# EasyEDA Pro project PCB_EasyEDA-Legacy.epro

# Schematic promicro_e22P_Tomas
Board Name: promicro_e22P_Tomas; Create Date: 2026-05-04; Page Name: Sheet_1; Project Name: promicro_e22P_30_2026-04-24_20-44-31; Schematic Name: promicro_e22P_Tomas; Update Date: 2026-05-27; Add into BOM: yes; Company: CNCnet; Convert to PCB: yes; Date: 2026-04-01; Draw By: Radek Vicek; REV: 1.1; Sheet: 1/1; spicePre: .
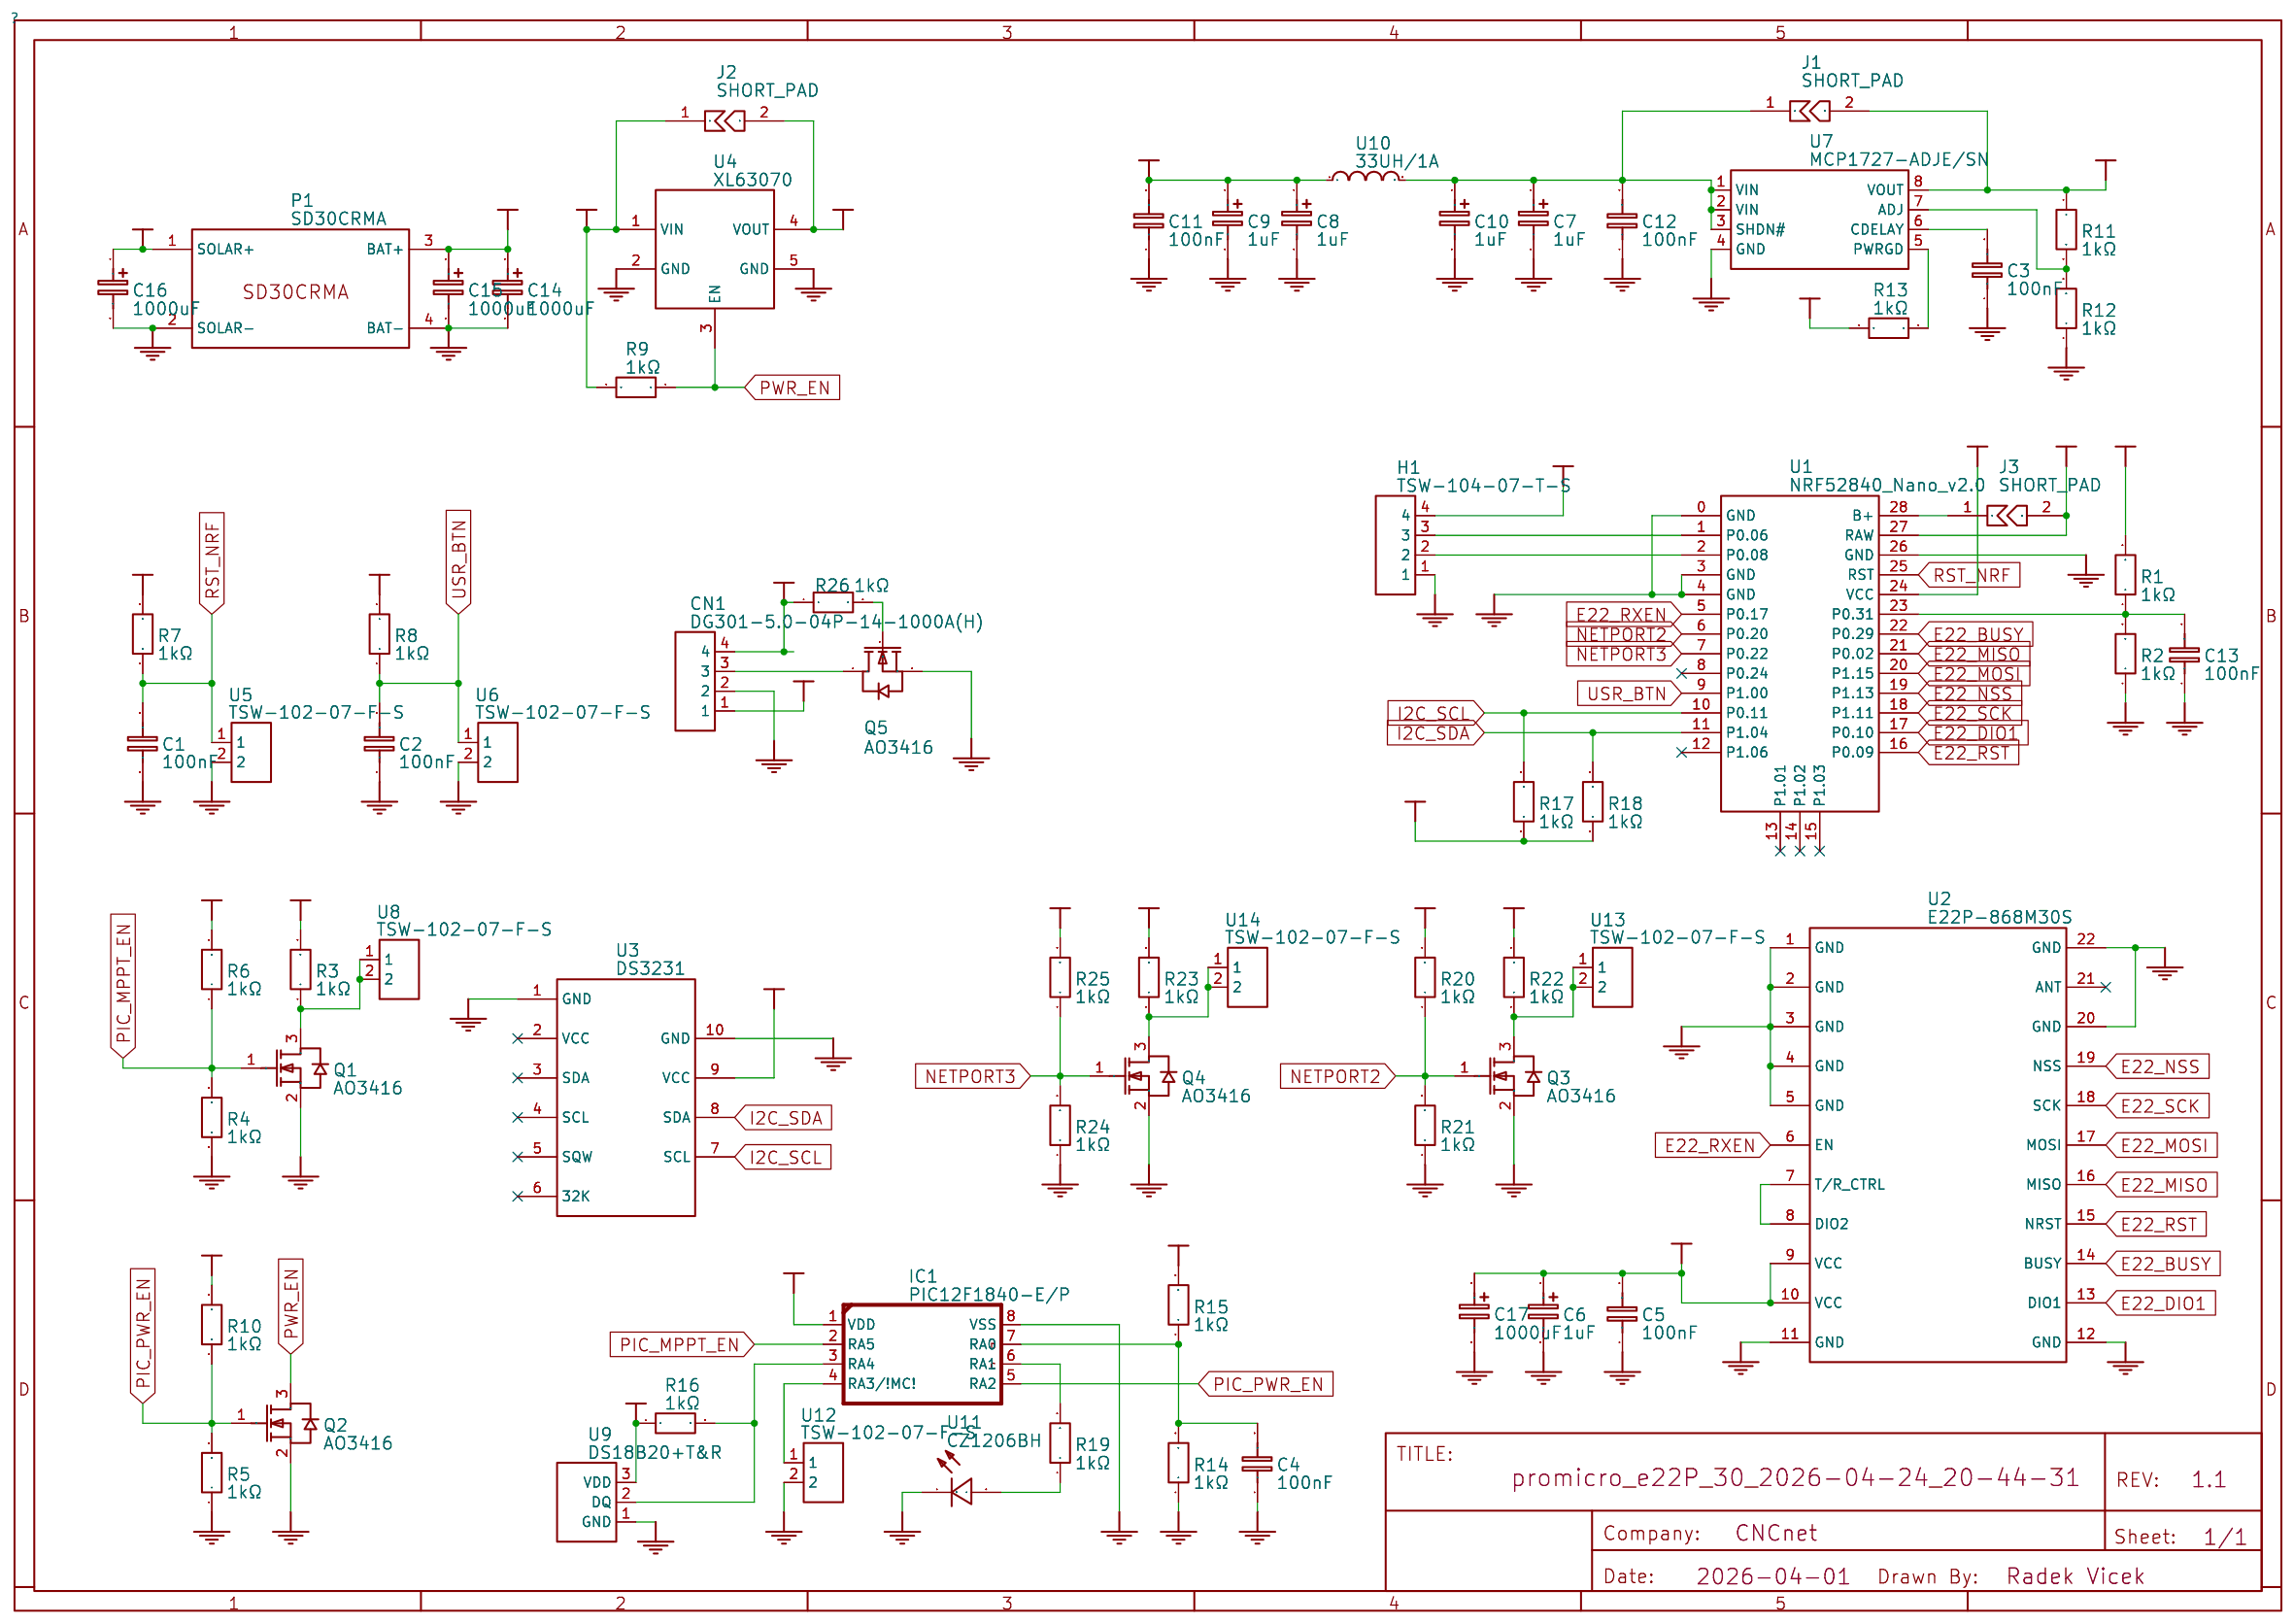
[diagram p0: schematic sheet]

## Parts
C1  100nF  [C1206]
C2  100nF  [C1206]
C3  100nF  [C1206]
C4  100nF  [C1206]
C5  100nF  [C1206]
C6  1uF  [CAP-SMD_L3.5-W2.8-R-RD]
C7  1uF  [CAP-SMD_L3.5-W2.8-R-RD]
C8  1uF  [CAP-SMD_L3.5-W2.8-R-RD]
C9  1uF  [CAP-SMD_L3.5-W2.8-R-RD]
C10  1uF  [CAP-SMD_L3.5-W2.8-R-RD]
C11  100nF  [C1206]
C12  100nF  [C1206]
C13  100nF  [C1206]
C14  1000uF  [CAP-D10.0×F5.0]
C15  1000uF  [CAP-D10.0×F5.0]
C16  1000uF  [CAP-D10.0×F5.0]
C17  1000uF  [CAP-D10.0×F5.0]
CN1  DG301-5.0-04P-14-1000A(H)  [CONN-TH_DEGSON_DG301-5.0-04P]
H1  TSW-104-07-T-S  [HDR-TH_4P-P2.54-V-M]
IC1  PIC12F1840-E/P  [DIL8-P]
J1  SHORT_PAD  [SHORT_PAD]
J2  SHORT_PAD  [SHORT_PAD]
J3  SHORT_PAD  [SHORT_PAD]
P1  SD30CRMA  [SD30CRMA]
Q1  AO3416  [SOT-23-3_L2.9-W1.3-P1.90-LS2.4-BR]
Q2  AO3416  [SOT-23-3_L2.9-W1.3-P1.90-LS2.4-BR]
Q3  AO3416  [SOT-23-3_L2.9-W1.3-P1.90-LS2.4-BR]
Q4  AO3416  [SOT-23-3_L2.9-W1.3-P1.90-LS2.4-BR]
Q5  AO3416  [SOT-23-3_L2.9-W1.3-P1.90-LS2.4-BR]
R1  1kΩ  [R1206]
R2  1kΩ  [R1206]
R3  1kΩ  [R1206]
R4  1kΩ  [R1206]
R5  1kΩ  [R1206]
R6  1kΩ  [R1206]
R7  1kΩ  [R1206]
R8  1kΩ  [R1206]
R9  1kΩ  [R1206]
R10  1kΩ  [R1206]
R11  1kΩ  [R1206]
R12  1kΩ  [R1206]
R13  1kΩ  [R1206]
R14  1kΩ  [R1206]
R15  1kΩ  [R1206]
R16  1kΩ  [R1206]
R17  1kΩ  [R1206]
R18  1kΩ  [R1206]
R19  1kΩ  [R1206]
R20  1kΩ  [R1206]
R21  1kΩ  [R1206]
R22  1kΩ  [R1206]
R23  1kΩ  [R1206]
R24  1kΩ  [R1206]
R25  1kΩ  [R1206]
R26  1kΩ  [R1206]
U1  NRF52840_Nano_v2.0  [NRF52840_NANO_V2,0]
U2  E22P-868M30S  [E22P-868M30S]
U3  DS3231  [DS3231]
U4  XL63070  [XL63070]
U5  TSW-102-07-F-S  [HDR-TH_2P-P2.54-V-M-3]
U6  TSW-102-07-F-S  [HDR-TH_2P-P2.54-V-M-3]
U7  MCP1727-ADJE/SN  [SOIC-8_L4.9-W3.9-P1.27-LS6.0-BL]
U8  TSW-102-07-F-S  [HDR-TH_2P-P2.54-V-M-3]
U9  DS18B20+T&R  [TO-92-3_L4.9-W3.7-P2.54-L]
U10  33UH/1A  [IND-TH_BD10.0-P5.00-D0.6]
U11  CZ1206BH  [LED-SMD_CZ1206BH]
U12  TSW-102-07-F-S  [HDR-TH_2P-P2.54-V-M-3]
U13  TSW-102-07-F-S  [HDR-TH_2P-P2.54-V-M-3]
U14  TSW-102-07-F-S  [HDR-TH_2P-P2.54-V-M-3]

## Library data of the parts
C1-C5 C11-C13 = CT41G-0805-2X1-50V-0.1uF-K(N): Capacitance:100nF Tolerance:±10% Tolerance:±10% Voltage Rating:50V Temperature Coefficient:-; LCSC Part Name: 100nF ±10% 50V; Supplier Part: C126469; Manufacturer: TORCH(火炬); Supplier Footprint: 0805; JLCPCB Part Class: Extended Part; Datasheet: https://item.szlcsc.com/datasheet/CT41G-0805-2X1-50V-0.1uF-K(N)/137749.html; Supplier: LCSC; Tolerance: ±10%; Voltage Rating: 50V
C6-C10 = TAJB105K035RNJ: Capacitance: Tolerance:±10% Tolerance:±10% Rated Voltage: Equivalent Series Resistance(ESR):6.5Ω@100kHz Operating Temperature:-55℃~+125℃ Operating Temperature:-55℃~+125℃; LCSC Part Name: 1uF ±10% 35V; Supplier Part: C7192; Manufacturer: Kyocera AVX; Supplier Footprint: CASE-B-3528-21(mm); JLCPCB Part Class: Extended Part; Datasheet: https://atta.szlcsc.com/upload/public/pdf/source/20160107/1457707750344.pdf; Supplier: LCSC; Tolerance: ±10%; Equivalent Series Resistance(ESR): 6.5Ω@100kHz; Operating Temperature: -55℃~+125℃
C14-C17 = PB25V1000M8X17: Capacitance:1000uF Tolerance:±20% Tolerance:±20% Voltage Rating:25V Ripple Current:4.5A@100kHz Equivalent Series Resistance(ESR):16mΩ@100kHz Type:Polymer Pin Spacing:3.5mm Diameter:8mm Height - Seated (Max):17mm Lifetime:5000hrs@105℃ Operating Temperature; LCSC Part Name: 1000uF ±20% 25V; Supplier Part: C51934175; Manufacturer: JIERR(捷而瑞); Supplier Footprint: 插件,D8xL17mm; JLCPCB Part Class: Extended Part; Datasheet: https://item.szlcsc.com/datasheet/PB25V1000M8X17/54649587.html; Supplier: LCSC; Tolerance: ±20%; Voltage Rating: 25V; Ripple Current: 4.5A@100kHz; Equivalent Series Resistance(ESR): 16mΩ@100kHz; Type: Polymer; Pin Spacing: 3.5mm; Diameter: 8mm; Height - Seated (Max): 17mm; Lifetime: 5000hrs@105℃; Operating Temperature: -55℃~+105℃
CN1 = DG301-5.0-04P-14-1000A(H): Supplier: LCSC; Supplier Part: C3037697; Manufacturer: DEGSON(高正/高松); JLCPCB Part Class: Extended Part; Contributor: lcsc; spicePre: C
H1 = TSW-104-07-T-S: Supplier: LCSC; Supplier Part: C7365925; Manufacturer: SAMTEC; JLCPCB Part Class: Extended Part; Contributor: lcsc; spicePre: H
IC1 = PIC12F1840-E/P: CPU Core:PIC CPU Maximum Speed:32MHz Core Size:8 Bit Program Storage Size:7KB Program Memory Type:FLASH RAM Size:256Byte EEPROM:256Byte Number of I/O:5 ADC (Bit):10bit DAC (Bit):5bit Oscillator Type:Built-in Voltage - Supply:2.3V~5.5V Voltage - Supply:2.3; LCSC Part Name: 采用XLP技术的8引脚闪存微控制器; Supplier Part: C640529; Manufacturer: MICROCHIP(美国微芯); Supplier Footprint: PDIP-8; JLCPCB Part Class: Extended Part; Datasheet: https://item.szlcsc.com/datasheet/PIC12F1840-E%252FP/670326.html; Supplier: LCSC; CPU Core: PIC; CPU Maximum Speed: 32MHz; Core Size: 8 Bit; Program Storage Size: 7KB; Program Memory Type: FLASH; RAM Size: 256Byte; EEPROM: 256Byte; Number of I/O: 5; ADC (Bit): 10bit; DAC (Bit): 5bit; Oscillator Type: Built-in; Voltage - Supply: 2.3V~5.5V; Operating Temperature: -40℃~+125℃
J1-J3 = SHORT_PAD: _: 3
P1 = SD30CRMA: Contributor: mrilic66; spicePre: P
Q1-Q5 = AO3416_C43307: Number:1 N-Channel Drain to Source Voltage:20V Current - Continuous Drain(Id):- RDS(on):22mΩ@4.5V,6.5A Pd - Power Dissipation:- Gate Threshold Voltage (Vgs(th)):1.1V Gate Charge(Qg):10nC@4.5V Input Capacitance(Ciss):1.65nF Reverse Transfer Capacitance (Cr; LCSC Part Name: 1个N沟道 耐压:20V 电流:6.5A; Supplier Part: C43307; Manufacturer: AOS; Supplier Footprint: SOT-23; JLCPCB Part Class: Extended Part; Datasheet: https://item.szlcsc.com/datasheet/AO3416/44298.html; Supplier: LCSC; Number: 1 N-Channel; Drain to Source Voltage: 20V; RDS(on): 22mΩ@4.5V,6.5A; Gate Threshold Voltage (Vgs(th)): 1.1V; Gate Charge(Qg): 10nC@4.5V; Input Capacitance(Ciss): 1.65nF; Reverse Transfer Capacitance (Crss@Vds): 87pF; Operating Temperature: -55℃~+150℃
R1-R26 = FRC0805J102 TS: Type:Thick Film Resistor Resistance:1kΩ Tolerance:±5% Tolerance:±5% Power(Watts):125mW Voltage-Supply(Max):150V Temperature Coefficient:±100ppm/℃ Temperature Coefficient:±100ppm/℃ Operating Temperature:-55℃~+155℃ Operating Temperature:-55℃~+155℃; LCSC Part Name: 1kΩ ±5% 125mW 厚膜电阻; Supplier Part: C2907295; Manufacturer: FOJAN(富捷); Supplier Footprint: 0805; JLCPCB Part Class: Extended Part; Supplier: LCSC; Type: Thick Film Resistor; Tolerance: ±5%; Power(Watts): 125mW; Voltage-Supply(Max): 150V; Temperature Coefficient: ±100ppm/℃; Operating Temperature: -55℃~+155℃
U1 = NRF52840_Nano_v2.0: Contributor: eugeniomercol; spicePre: U
U2 = E22P-868M30S: Supplier Part: C51912689; Manufacturer: EBYTE(亿佰特); Supplier Footprint: SMD,38.5x24mm; JLCPCB Part Class: Extended Part; Supplier: LCSC
U3 = DS3231: Manufacturer: IIOTSME; Supplier: IIOTSME; Contributor: mazran.iiotsme; spicePre: U
U4 = XL63070: Contributor: willyjestrabek; spicePre: U
U5 U6 U8 U12-U14 = TSW-102-07-F-S: Supplier: LCSC; Supplier Part: C3331037; Manufacturer: SAMTEC; JLCPCB Part Class: Extended Part; Contributor: lcsc; spicePre: U
U7 = MCP1727-ADJE/SN: Supplier: LCSC; Supplier Part: C635937; Manufacturer: MICROCHIP(美国微芯); JLCPCB Part Class: Extended Part; Contributor: LCSC; spicePre: U
U9 = DS18B20+T&R: Supplier: LCSC; Supplier Part: C880672; Manufacturer: ADI(亚德诺)/MAXIM(美信); JLCPCB Part Class: Extended Part; Contributor: LCSC; spicePre: U; spiceSymbolName: DS18B20+T&amp;R
U10 = 33UH/1A: Supplier: LCSC; Supplier Part: C9900019827; Manufacturer: null; Manufacturer Part: 33uH/1A; JLCPCB Part Class: Extended Part; Contributor: lcsc; spicePre: U
U11 = CZ1206BH: Supplier: LCSC; Supplier Part: C9900198175; Manufacturer: null; JLCPCB Part Class: Extended Part; Contributor: lcsc; spicePre: U

## Nets
+3V3: H1.4 R3.2 R6.2 R7.2 R8.2 R10.2 R17.1 R18.1 R20.2 R22.2 R23.2 R25.2 U1.24(VCC) U3.9(VCC)
+5V: C8.1 C9.1 C11.2 J2.2 U4.4(VOUT) U10.1
GND: C1.1 C2.1 C3.1 C4.1 C5.1 C6.2 C7.2 C8.2 C9.2 C10.2 C11.1 C12.1 C13.1 C14.2 C15.2 C16.2 C17.2 CN1.2 H1.1 IC1.8(VSS) P1.2(SOLAR-) P1.4(BAT-) Q1.2(S) Q2.2(S) Q3.2(S) Q4.2(S) Q5.2(S) R2.1 R4.1 R5.1 R12.1 R14.1 R21.1 R24.1 U1.0(GND) U1.3(GND) U1.4(GND) U1.26(GND) U2.1(GND) U2.2(GND) U2.3(GND) U2.4(GND) U2.5(GND) U2.11(GND) U2.12(GND) U2.20(GND) U2.22(GND) U3.1(GND) U3.10(GND) U4.2(GND) U4.5(GND) U5.2 U6.2 U7.4(GND) U9.1(GND) U11.1(C) U12.2
VBAT: C14.1 C15.1 CN1.4 IC1.1(VDD) J2.1 P1.3(BAT+) R1.2 R9.2 R15.2 R16.1 R26.1 U4.1(VIN) U9.3(VDD)
E22_BUSY: U1.22(P0.29) U2.14(BUSY)
E22_DIO1: U1.17(P0.10) U2.13(DIO1)
E22_MISO: U1.21(P0.02) U2.16(MISO)
E22_MOSI: U1.20(P1.15) U2.17(MOSI)
E22_NSS: U1.19(P1.13) U2.19(NSS)
E22_RST: U1.16(P0.09) U2.15(NRST)
E22_RXEN: U1.5(P0.17) U2.6(EN)
E22_SCK: U1.18(P1.11) U2.18(SCK)
I2C_SCL: R17.2 U1.10(P0.11) U3.7(SCL)
I2C_SDA: R18.2 U1.11(P1.04) U3.8(SDA)
NETPORT2: Q3.1(G) R20.1 R21.2 U1.6(P0.20)
NETPORT3: Q4.1(G) R24.2 R25.1 U1.7(P0.22)
PIC_MPPT_EN: IC1.2(RA5) Q1.1(G) R4.2 R6.1
PIC_PWR_EN: IC1.5(RA2) Q2.1(G) R5.2 R10.1
PWR_EN: Q2.3(D) R9.1 U4.3(EN)
RST_NRF: C1.2 R7.1 U1.25(RST) U5.1
USR_BTN: C2.2 R8.1 U1.9(P1.00) U6.1
VRAW: C5.2 C6.1 C17.1 J1.2 J3.2 R11.1 R13.2 U1.27(RAW) U2.9(VCC) U2.10(VCC) U7.8(VOUT)
VSOL: C16.1 CN1.1 P1.1(SOLAR+)
$1N10: U2.7(T/R CTRL) U2.8(DIO2)
$1N12: C13.2 R1.1 R2.2 U1.23(P0.31)
$1N32: Q1.3(D) R3.1 U8.1 U8.2
$1N33: R13.1 U7.5(PWRGD)
$1N35: C3.2 U7.6(CDELAY)
$1N37: R11.2 R12.2 U7.7(ADJ)
$1N43: IC1.3(RA4) R16.2 U9.2(DQ)
$1N45: C4.2 IC1.7(RA0) R14.2 R15.1
$1N53: C7.1 C10.1 C12.2 J1.1 U7.1(VIN) U7.2(VIN) U7.3(SHDN#) U10.2
$1N58: H1.3 U1.1(P0.06)
$1N62: H1.2 U1.2(P0.08)
$1N68: R19.1 U11.2(A)
$1N69: IC1.6(RA1) R19.2
$1N72: IC1.4(RA3/!MC!) U12.1
$1N75: Q3.3(D) R22.1 U13.1 U13.2
$1N84: Q4.3(D) R23.1 U14.1 U14.2
$1N86: J3.1 U1.28(B+)
$1N3345: CN1.3 Q5.3(D)
$1N3704: Q5.1(G) R26.2

Not connected (* = marked no-connect by the designer): U1 8(P0.24)* 12(P1.06)* 13(P1.01)* 14(P1.02)* 15(P1.03)*; U2 21(ANT)*; U3 2(VCC)* 3(SDA)* 4(SCL)* 5(SQW)* 6(32K)*

# Schematic promicro_e22P_30
Board Name: promicro_e22P_30; Create Date: 2026-04-24; Page Name: Sheet_1; Project Name: promicro_e22P_30_2026-04-24_20-44-31; Schematic Name: promicro_e22P_30; Update Date: 2026-04-24; Add into BOM: yes; Company: CNCnet; Convert to PCB: yes; Date: 2026-04-01; Draw By: Radek Vicek; REV: 1.0; Sheet: 1/1; spicePre: .
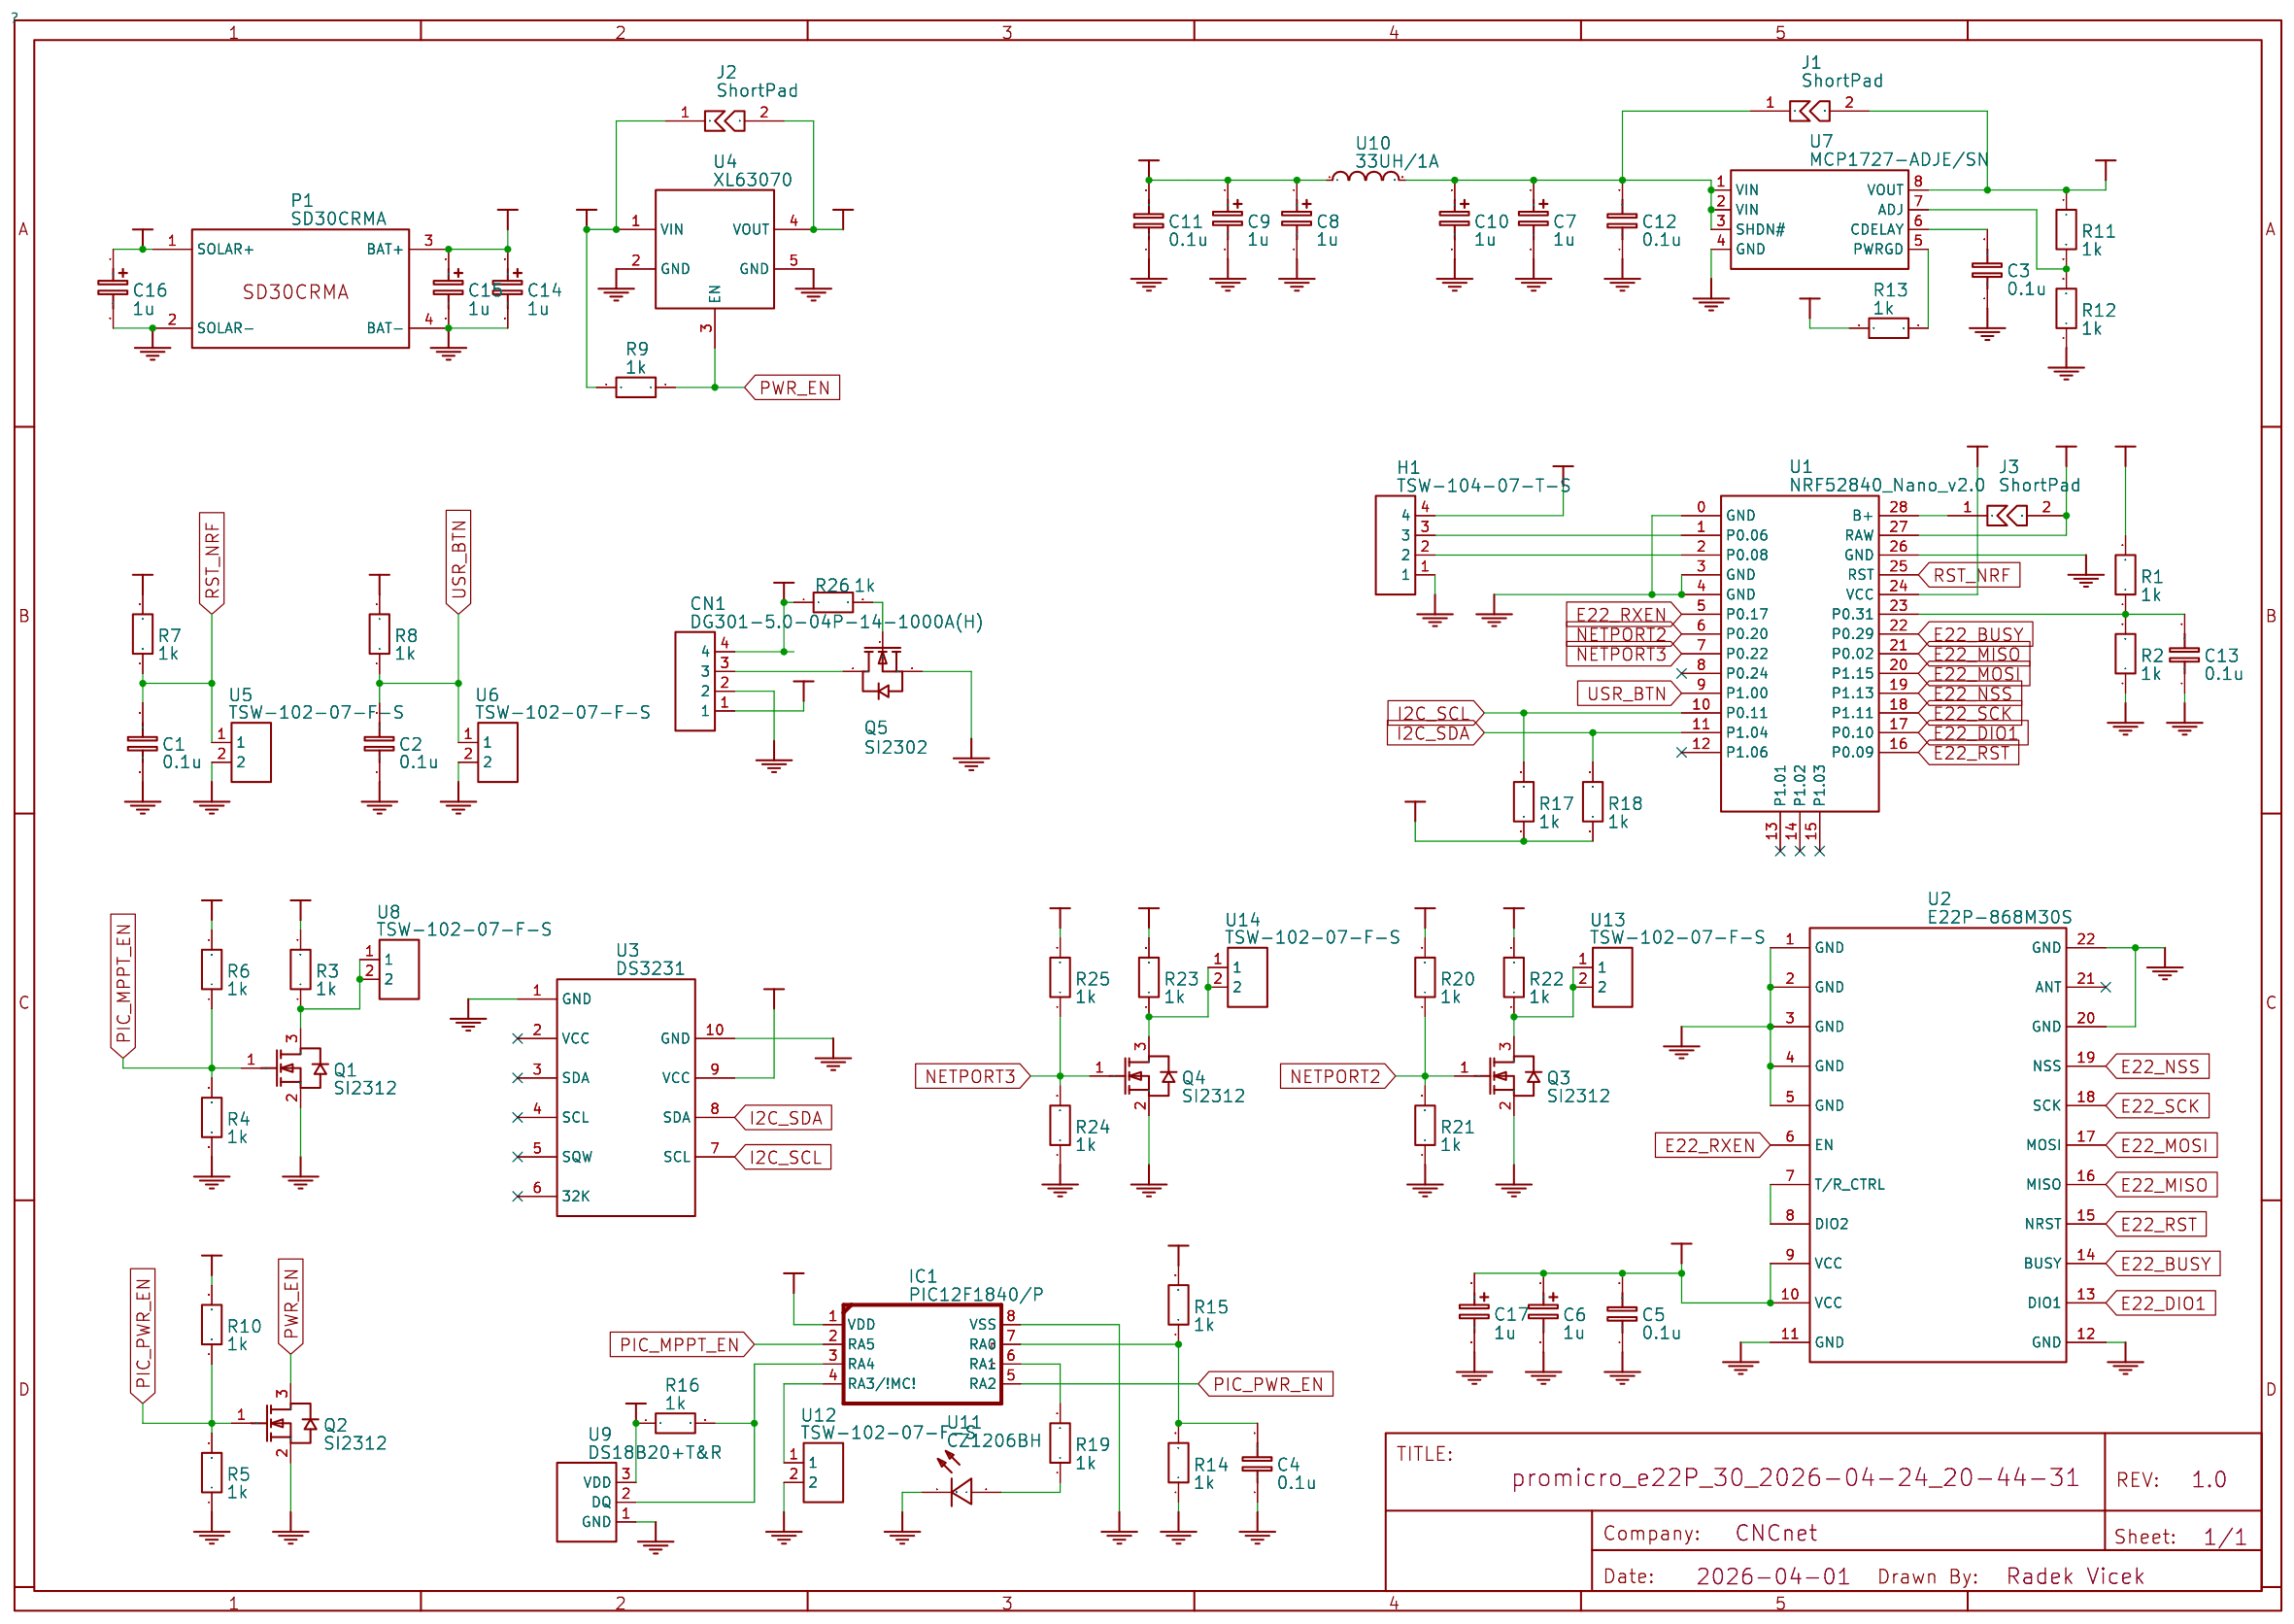
[diagram p1: schematic sheet]

## Parts
C1  0.1u  [C1206]
C2  0.1u  [C1206]
C3  0.1u  [C1206]
C4  0.1u  [C1206]
C5  0.1u  [C1206]
C6  1u  [CASE-B_3528]
C7  1u  [CASE-B_3528]
C8  1u  [CASE-B_3528]
C9  1u  [CASE-B_3528]
C10  1u  [CASE-B_3528]
C11  0.1u  [C1206]
C12  0.1u  [C1206]
C13  0.1u  [C1206]
C14  1u  [CAP-D10.0×F5.0]
C15  1u  [CAP-D10.0×F5.0]
C16  1u  [CAP-D10.0×F5.0]
C17  1u  [CAP-D10.0×F5.0]
CN1  DG301-5.0-04P-14-1000A(H)  [CONN-TH_DEGSON_DG301-5.0-04P]
H1  TSW-104-07-T-S  [HDR-TH_4P-P2.54-V-M]
IC1  PIC12F1840/P  [DIL8-P]
J1  ShortPad  [SHORTPAD]
J2  ShortPad  [SHORTPAD]
J3  ShortPad  [SHORTPAD]
P1  SD30CRMA  [SD30CRMA]
Q1  SI2312  [SOT-23-3_L2.9-W1.3-P1.90-LS2.4-BR]
Q2  SI2312  [SOT-23-3_L2.9-W1.3-P1.90-LS2.4-BR]
Q3  SI2312  [SOT-23-3_L2.9-W1.3-P1.90-LS2.4-BR]
Q4  SI2312  [SOT-23-3_L2.9-W1.3-P1.90-LS2.4-BR]
Q5  SI2302  [SOT-23-3_L2.9-W1.3-P1.90-LS2.4-BR]
R1  1k  [R1206]
R2  1k  [R1206]
R3  1k  [R1206]
R4  1k  [R1206]
R5  1k  [R1206]
R6  1k  [R1206]
R7  1k  [R1206]
R8  1k  [R1206]
R9  1k  [R1206]
R10  1k  [R1206]
R11  1k  [R1206]
R12  1k  [R1206]
R13  1k  [R1206]
R14  1k  [R1206]
R15  1k  [R1206]
R16  1k  [R1206]
R17  1k  [R1206]
R18  1k  [R1206]
R19  1k  [R1206]
R20  1k  [R1206]
R21  1k  [R1206]
R22  1k  [R1206]
R23  1k  [R1206]
R24  1k  [R1206]
R25  1k  [R1206]
R26  1k  [R1206]
U1  NRF52840_Nano_v2.0  [NRF52840_NANO_V2,0]
U2  E22P-868M30S  [E22P-868M30S]
U3  DS3231  [DS3231]
U4  XL63070  [XL63070]
U5  TSW-102-07-F-S  [HDR-TH_2P-P2.54-V-M-3]
U6  TSW-102-07-F-S  [HDR-TH_2P-P2.54-V-M-3]
U7  MCP1727-ADJE/SN  [SOIC-8_L4.9-W3.9-P1.27-LS6.0-BL]
U8  TSW-102-07-F-S  [HDR-TH_2P-P2.54-V-M-3]
U9  DS18B20+T&R  [TO-92-3_L4.9-W3.7-P2.54-L]
U10  33UH/1A  [IND-TH_BD10.0-P5.00-D0.6]
U11  CZ1206BH  [LED-SMD_CZ1206BH]
U12  TSW-102-07-F-S  [HDR-TH_2P-P2.54-V-M-3]
U13  TSW-102-07-F-S  [HDR-TH_2P-P2.54-V-M-3]
U14  TSW-102-07-F-S  [HDR-TH_2P-P2.54-V-M-3]

## Library data of the parts
C1-C5 C11-C13 = 0.1u: nameAlias: Value(F); Contributor: LCEDA_Lib; spicePre: C; spiceSymbolName: C_1206_EU
C6-C10 = 1u: nameAlias: Value(F); Contributor: LCEDA_Lib; spicePre: C; spiceSymbolName: C_Tan_SMD_B_EU
C14-C17 = 1u: nameAlias: Value(F); Contributor: LCEDA_Lib; spicePre: C; spiceSymbolName: CE_TH_D10.0×F5.0_EU
CN1 = DG301-5.0-04P-14-1000A(H): Supplier: LCSC; Supplier Part: C3037697; Manufacturer: DEGSON(高正/高松); JLCPCB Part Class: Extended Part; Contributor: lcsc; spicePre: C
H1 = TSW-104-07-T-S: Supplier: LCSC; Supplier Part: C7365925; Manufacturer: SAMTEC; JLCPCB Part Class: Extended Part; Contributor: lcsc; spicePre: H
IC1 = PIC12F1840/P: Contributor: kev.lum.10; spicePre: I
J1-J3 = ShortPad: Contributor: Prof.Es.Sional; spicePre: J
P1 = SD30CRMA: Contributor: mrilic66; spicePre: P
Q1-Q4 = SI2312: Supplier: LCSC; Supplier Part: C351405; Manufacturer: PUOLOP(迪浦); JLCPCB Part Class: Extended Part; Contributor: LCSC; spicePre: Q
Q5 = SI2302_C20628873: Number:1 N-Channel Drain to Source Voltage:20V Current - Continuous Drain(Id):3.3A RDS(on):75mΩ@2.5V Pd - Power Dissipation:1W Gate Threshold Voltage (Vgs(th)):1.5V@250uA Type:N-Channel; LCSC Part Name: 1个N沟道 耐压:20V 电流:3.3A; Supplier Part: C20628873; Manufacturer: FOSAN(富捷/富信); Supplier Footprint: SOT-23; JLCPCB Part Class: Extended Part; Datasheet: https://item.szlcsc.com/datasheet/SI2302/22043121.html; Supplier: LCSC; Number: 1 N-Channel; Drain to Source Voltage: 20V; Current - Continuous Drain(Id): 3.3A; RDS(on): 75mΩ@2.5V; Pd - Power Dissipation: 1W; Gate Threshold Voltage (Vgs(th)): 1.5V@250uA; Type: N-Channel
R1-R26 = 1k: nameAlias: Value(Ω); Contributor: LCEDA_Lib; spicePre: R; spiceSymbolName: R_1206_EU
U1 = NRF52840_Nano_v2.0: Contributor: eugeniomercol; spicePre: U
U2 = E22P-868M30S: Manufacturer: EBYTE; link: https://es.aliexpress.com/item/1005010297548005.html?aff_fcid=98de9c34a33349b49ae8ec5e9a0dc322-1773168861794-01273-_c3Rd26sf&aff_fsk=_c3Rd26sf&aff_platform=api-new-link-generate&sk=_c3Rd26sf&aff_trace_key=98de9c34a33349b49ae8ec5e9a0dc322-1773168861794-01273-_c3Rd26sf&terminal_id=b1642692874a40f0a20add40a61b4ff8&afSmartRedirect=y; Contributor: claudiu2001; spicePre: U
U3 = DS3231: Manufacturer: IIOTSME; Supplier: IIOTSME; Contributor: mazran.iiotsme; spicePre: U
U4 = XL63070: Contributor: willyjestrabek; spicePre: U
U5 U6 U8 U12-U14 = TSW-102-07-F-S: Supplier: LCSC; Supplier Part: C3331037; Manufacturer: SAMTEC; JLCPCB Part Class: Extended Part; Contributor: lcsc; spicePre: U
U7 = MCP1727-ADJE/SN: Supplier: LCSC; Supplier Part: C635937; Manufacturer: MICROCHIP(美国微芯); JLCPCB Part Class: Extended Part; Contributor: LCSC; spicePre: U
U9 = DS18B20+T&R: Supplier: LCSC; Supplier Part: C880672; Manufacturer: ADI(亚德诺)/MAXIM(美信); JLCPCB Part Class: Extended Part; Contributor: LCSC; spicePre: U; spiceSymbolName: DS18B20+T&amp;R
U10 = 33UH/1A: Supplier: LCSC; Supplier Part: C9900019827; Manufacturer: null; Manufacturer Part: 33uH/1A; JLCPCB Part Class: Extended Part; Contributor: lcsc; spicePre: U
U11 = CZ1206BH: Supplier: LCSC; Supplier Part: C9900198175; Manufacturer: null; JLCPCB Part Class: Extended Part; Contributor: lcsc; spicePre: U

## Nets
+3V3: H1.4 R3.2 R6.2 R7.2 R8.2 R10.2 R17.1 R18.1 R20.2 R22.2 R23.2 R25.2 U1.24(VCC) U3.9(VCC)
+5V: C8.1 C9.1 C11.2 J2.2 U4.4(VOUT) U10.1
GND: C1.1 C2.1 C3.1 C4.1 C5.1 C6.2 C7.2 C8.2 C9.2 C10.2 C11.1 C12.1 C13.1 C14.2 C15.2 C16.2 C17.2 CN1.2 H1.1 IC1.8(VSS) P1.2(SOLAR-) P1.4(BAT-) Q1.2(S) Q2.2(S) Q3.2(S) Q4.2(S) Q5.2(S) R2.1 R4.1 R5.1 R12.1 R14.1 R21.1 R24.1 U1.0(GND) U1.3(GND) U1.4(GND) U1.26(GND) U2.1(GND) U2.2(GND) U2.3(GND) U2.4(GND) U2.5(GND) U2.11(GND) U2.12(GND) U2.20(GND) U2.22(GND) U3.1(GND) U3.10(GND) U4.2(GND) U4.5(GND) U5.2 U6.2 U7.4(GND) U9.1(GND) U11.1(C) U12.2
VBAT: C14.1 C15.1 CN1.4 IC1.1(VDD) J2.1 P1.3(BAT+) R1.2 R9.2 R15.2 R16.1 R26.1 U4.1(VIN) U9.3(VDD)
E22_BUSY: U1.22(P0.29) U2.14(BUSY)
E22_DIO1: U1.17(P0.10) U2.13(DIO1)
E22_MISO: U1.21(P0.02) U2.16(MISO)
E22_MOSI: U1.20(P1.15) U2.17(MOSI)
E22_NSS: U1.19(P1.13) U2.19(NSS)
E22_RST: U1.16(P0.09) U2.15(NRST)
E22_RXEN: U1.5(P0.17) U2.6(EN)
E22_SCK: U1.18(P1.11) U2.18(SCK)
I2C_SCL: R17.2 U1.10(P0.11) U3.7(SCL)
I2C_SDA: R18.2 U1.11(P1.04) U3.8(SDA)
NETPORT2: Q3.1(G) R20.1 R21.2 U1.6(P0.20)
NETPORT3: Q4.1(G) R24.2 R25.1 U1.7(P0.22)
PIC_MPPT_EN: IC1.2(RA5) Q1.1(G) R4.2 R6.1
PIC_PWR_EN: IC1.5(RA2) Q2.1(G) R5.2 R10.1
PWR_EN: Q2.3(D) R9.1 U4.3(EN)
RST_NRF: C1.2 R7.1 U1.25(RST) U5.1
USR_BTN: C2.2 R8.1 U1.9(P1.00) U6.1
VRAW: C5.2 C6.1 C17.1 J1.2 J3.2 R11.1 R13.2 U1.27(RAW) U2.9(VCC) U2.10(VCC) U7.8(VOUT)
VSOL: C16.1 CN1.1 P1.1(SOLAR+)
$1N10: U2.7(T/R CTRL) U2.8(DIO2)
$1N12: C13.2 R1.1 R2.2 U1.23(P0.31)
$1N32: Q1.3(D) R3.1 U8.1 U8.2
$1N33: R13.1 U7.5(PWRGD)
$1N35: C3.2 U7.6(CDELAY)
$1N37: R11.2 R12.2 U7.7(ADJ)
$1N43: IC1.3(RA4) R16.2 U9.2(DQ)
$1N45: C4.2 IC1.7(RA0) R14.2 R15.1
$1N53: C7.1 C10.1 C12.2 J1.1 U7.1(VIN) U7.2(VIN) U7.3(SHDN#) U10.2
$1N58: H1.3 U1.1(P0.06)
$1N62: H1.2 U1.2(P0.08)
$1N68: R19.1 U11.2(A)
$1N69: IC1.6(RA1) R19.2
$1N72: IC1.4(RA3/!MC!) U12.1
$1N75: Q3.3(D) R22.1 U13.1 U13.2
$1N84: Q4.3(D) R23.1 U14.1 U14.2
$1N86: J3.1 U1.28(B+)
$1N3345: CN1.3 Q5.3(D)
$1N3704: Q5.1(G) R26.2

Not connected (* = marked no-connect by the designer): U1 8(P0.24)* 12(P1.06)* 13(P1.01)* 14(P1.02)* 15(P1.03)*; U2 21(ANT)*; U3 2(VCC)* 3(SDA)* 4(SCL)* 5(SQW)* 6(32K)*

# Board PCB_promicro_e22P_30_Tomas
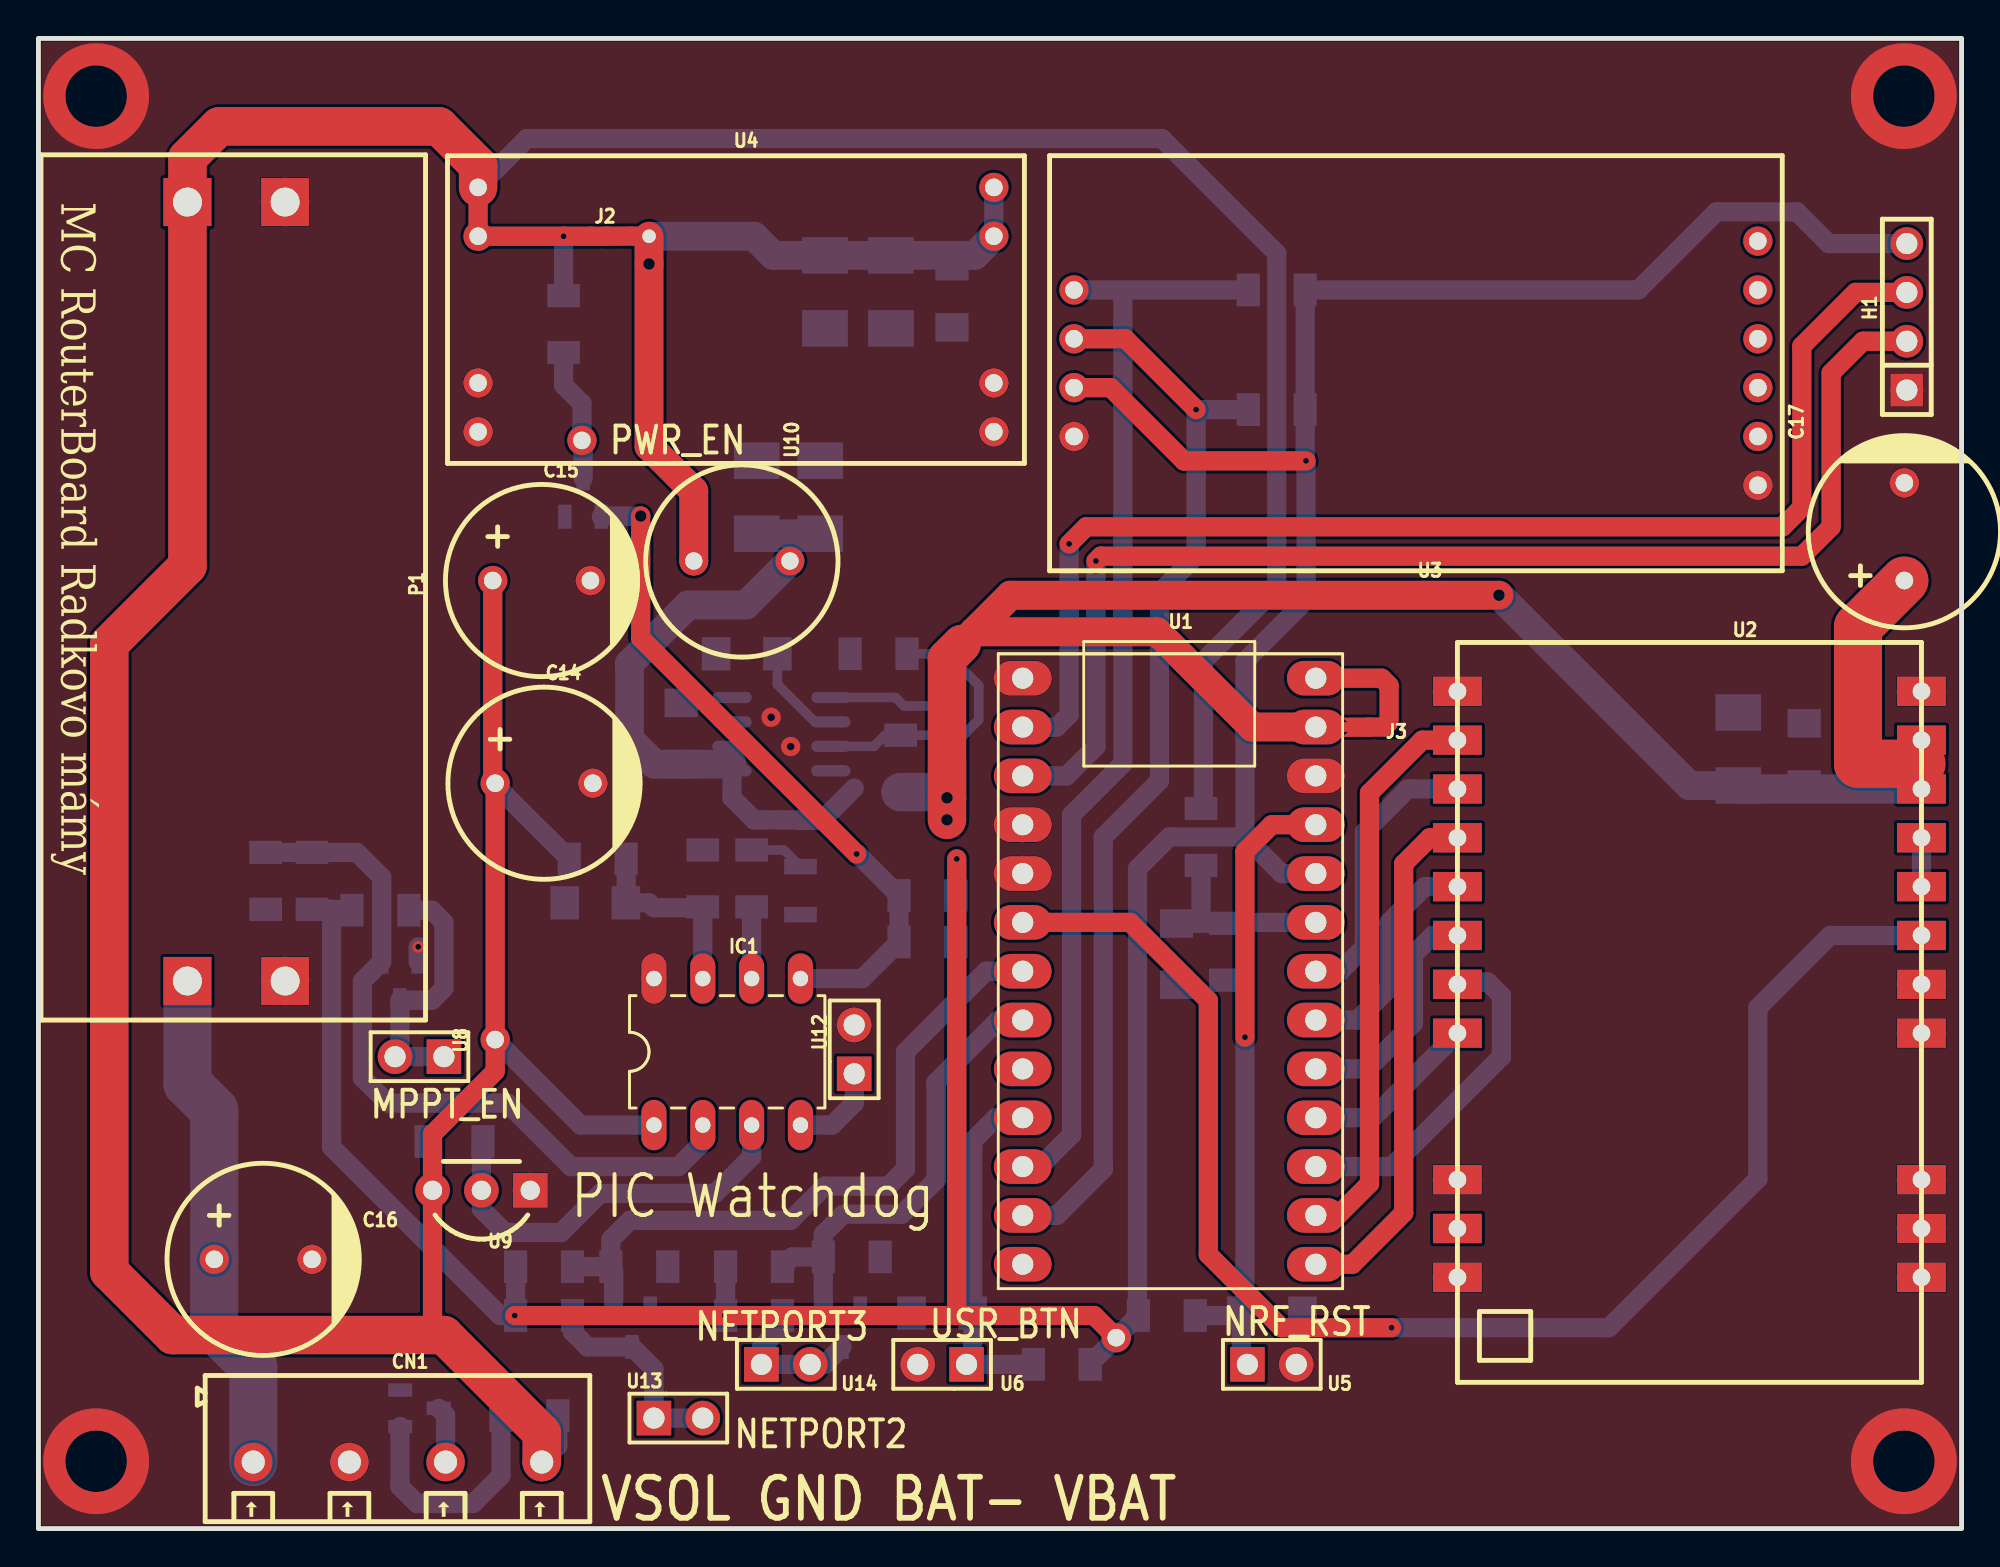
[diagram p2: board, top side]
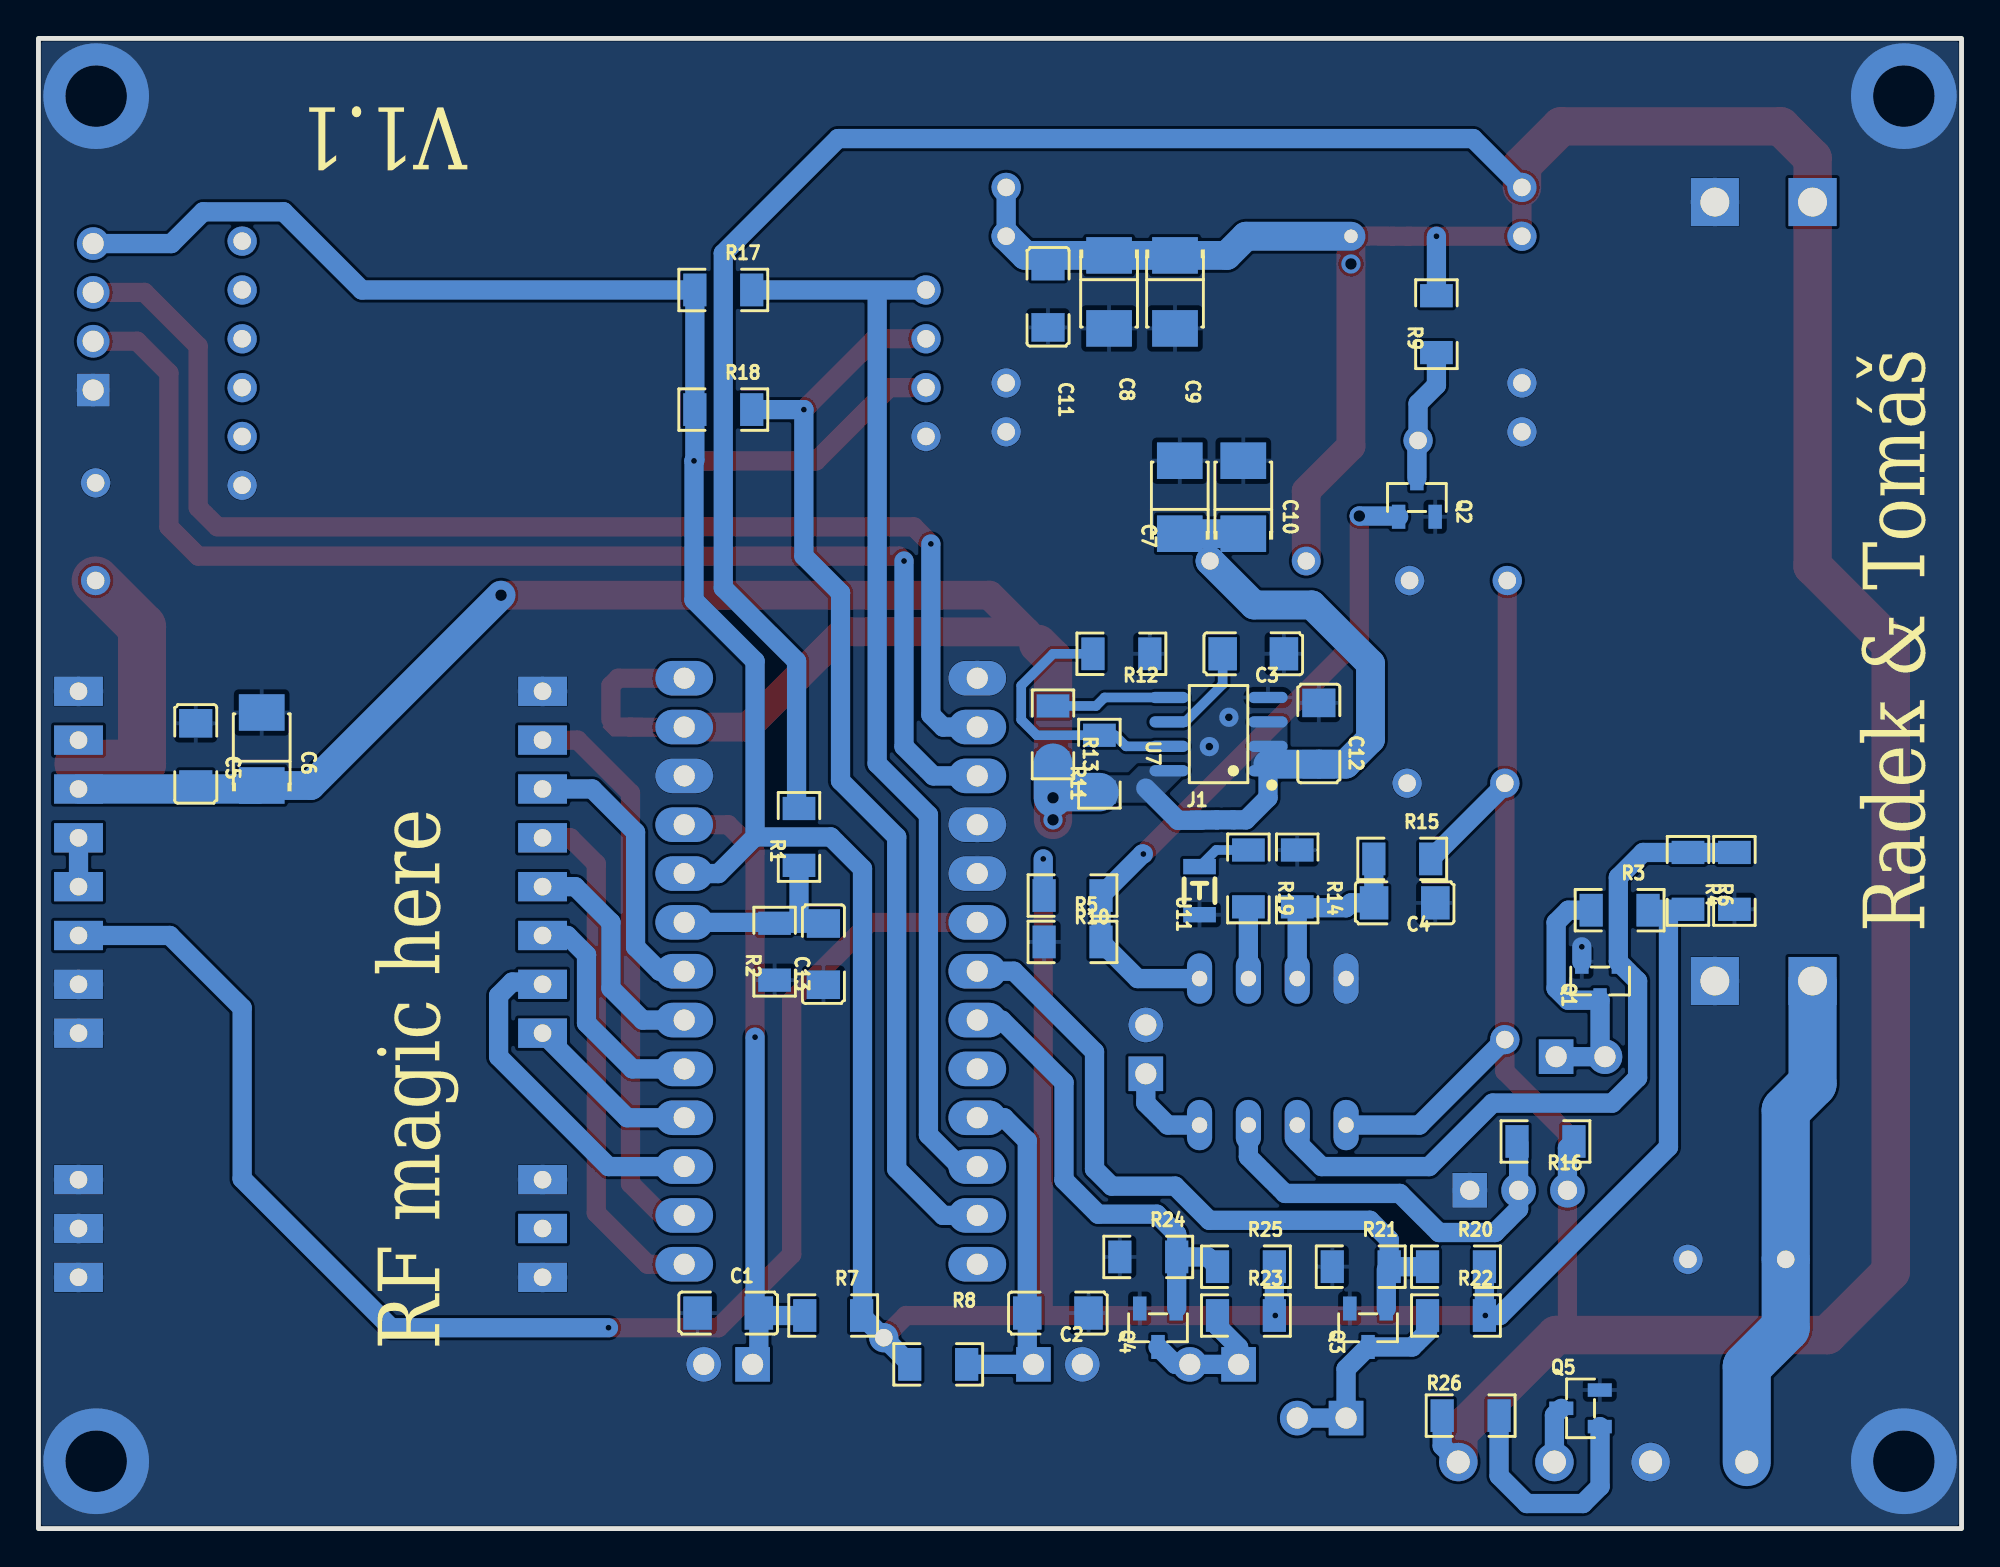
[diagram p3: board, bottom side, seen from below]

Outline 100 x 77.5 mm; copper layers: Top Layer, Bottom Layer. Coordinates in mm from the lower left corner of the outline.
Outline path: rectangle 0,77.5 100,0
Stack: Top Layer 0.035mm / Dielectric1 1.51mm FR4 er 4.5 / Bottom Layer 0.035mm

## Design rules (mm)
spacing Default (default): track to track 0.152, other pairs 0 to 0.152
spacing Plane_Default: track to track 0.152, other pairs 0 to 0.152
spacing Copper_Default: track to track 0.152, other pairs 0 to 0.152
track width Default (default): min 0.254, default 0.254, max 25.4
differential pair differentialPair (default): width min 0.127, default 0.254, max 2.54; gap min 0.152, default 0.152
pour e303 uses Copper_Default
pour e426 uses Copper_Default

## Placement (name value [footprint] x y rotation side)
C1  100nF  [C1206]  64.13 11.21 180 bottom
C2  100nF  [C1206]  46.99 11.21 0 bottom
C3  100nF  [C1206]  36.83 45.5 0 bottom
C4  100nF  [C1206]  28.96 32.54 0 bottom
C5  100nF  [C1206]  91.82 40.29 270 bottom
C6  1uF  [CAP-SMD_L3.5-W2.8-R-RD]  88.39 40.54 270 bottom
C7  1uF  [CAP-SMD_L3.5-W2.8-R-RD]  40.65 53.64 270 bottom
C8  1uF  [CAP-SMD_L3.5-W2.8-R-RD]  44.33 64.32 90 bottom
C9  1uF  [CAP-SMD_L3.5-W2.8-R-RD]  40.9 64.32 90 bottom
C10  1uF  [CAP-SMD_L3.5-W2.8-R-RD]  37.35 53.64 270 bottom
C11  100nF  [C1206]  47.5 64.06 90 bottom
C12  100nF  [C1206]  33.42 41.35 270 bottom
C13  100nF  [C1206]  59.18 29.88 90 bottom
C14  1000uF  [CAP-D10.0×F5.0]  26.29 38.77 0 top
C15  1000uF  [CAP-D10.0×F5.0]  26.16 49.31 0 top
C16  1000uF  [CAP-D10.0×F5.0]  11.68 14 0 top
C17  1000uF  [CAP-D10.0×F5.0]  97.03 51.85 90 top
CN1  DG301-5.0-04P-14-1000A(H)  [CONN-TH_DEGSON_DG301-5.0-04P]  18.67 3.46 0 top
H1  TSW-104-07-T-S  [HDR-TH_4P-P2.54-V-M]  97.16 63.02 90 top
IC1  PIC12F1840-E/P  [DIL8-P]  35.81 24.8 0 top
J1  -  [SHORT_PAD]  38.35 36.86 0 bottom
J2  -  [SHORT_PAD]  29.21 67.21 0 top
J3  -  [SHORT_PAD]  69.6 41.69 180 top
NOREF  -  [Pad_e19]  23.75 25.43 0 top
NOREF#2  -  [Pad_e20]  56.04 9.93 0 top
NOREF#3  -  [Pad_e21]  31.75 67.21 0 top
P1  -  [SD30CRMA]  0.13 26.45 90 top
Q1  AO3416  [SOT-23-3_L2.9-W1.3-P1.90-LS2.4-BR]  18.8 28.48 90 bottom
Q2  AO3416  [SOT-23-3_L2.9-W1.3-P1.90-LS2.4-BR]  28.32 53.62 270 bottom
Q3  AO3416  [SOT-23-3_L2.9-W1.3-P1.90-LS2.4-BR]  30.86 10.44 90 bottom
Q4  AO3416  [SOT-23-3_L2.9-W1.3-P1.90-LS2.4-BR]  41.78 10.44 90 bottom
Q5  AO3416  [SOT-23-3_L2.9-W1.3-P1.90-LS2.4-BR]  19.81 6.25 180 bottom
R1  1kΩ  [R1206]  60.45 35.97 90 bottom
R2  1kΩ  [R1206]  61.72 30 90 bottom
R3  1kΩ  [R1206]  17.78 32.16 180 bottom
R4  1kΩ  [R1206]  11.81 33.69 90 bottom
R5  1kΩ  [R1206]  46.23 30.51 180 bottom
R6  1kΩ  [R1206]  14.22 33.69 270 bottom
R7  1kΩ  [R1206]  58.67 11.08 180 bottom
R8  1kΩ  [R1206]  53.21 8.54 0 bottom
R9  1kΩ  [R1206]  27.31 62.64 90 bottom
R10  1kΩ  [R1206]  46.23 32.92 0 bottom
R11  1kΩ  [R1206]  44.83 39.78 90 bottom
R12  1kΩ  [R1206]  43.69 45.5 0 bottom
R13  1kΩ  [R1206]  47.24 41.31 270 bottom
R14  1kΩ  [R1206]  34.54 33.81 270 bottom
R15  1kΩ  [R1206]  29.08 34.83 180 bottom
R16  1kΩ  [R1206]  21.64 20.13 0 bottom
R17  1kΩ  [R1206]  64.39 64.42 180 bottom
R18  1kΩ  [R1206]  64.39 58.2 180 bottom
R19  1kΩ  [R1206]  37.08 33.81 270 bottom
R20  1kΩ  [R1206]  26.29 13.62 180 bottom
R21  1kΩ  [R1206]  31.24 13.62 180 bottom
R22  1kΩ  [R1206]  26.29 11.08 180 bottom
R23  1kΩ  [R1206]  37.21 11.08 180 bottom
R24  1kΩ  [R1206]  42.29 14.13 180 bottom
R25  1kΩ  [R1206]  37.21 13.62 180 bottom
R26  1kΩ  [R1206]  25.53 5.87 180 bottom
U1  NRF52840_Nano_v2.0  [NRF52840_NANO_V2,0]  50.04 12.48 0 top
U2  -  [E22P-868M30S]  85.85 28.31 0 top
U3  -  [DS3231]  88.14 55.53 180 top
U4  -  [XL63070]  22.86 69.75 0 top
U5  TSW-102-07-F-S  [HDR-TH_2P-P2.54-V-M-3]  64.13 8.54 0 top
U6  TSW-102-07-F-S  [HDR-TH_2P-P2.54-V-M-3]  46.99 8.54 180 top
U7  MCP1727-ADJE/SN  [SOIC-8_L4.9-W3.9-P1.27-LS6.0-BL]  38.63 41.32 90 bottom
U8  TSW-102-07-F-S  [HDR-TH_2P-P2.54-V-M-3]  19.81 24.54 180 top
U9  DS18B20+T&R  [TO-92-3_L4.9-W3.7-P2.54-L]  23.03 17.59 180 top
U10  33UH/1A  [IND-TH_BD10.0-P5.00-D0.6]  36.58 50.32 0 top
U11  CZ1206BH  [LED-SMD_CZ1206BH]  39.62 33.18 90 bottom
U12  TSW-102-07-F-S  [HDR-TH_2P-P2.54-V-M-3]  42.42 24.92 90 top
U13  TSW-102-07-F-S  [HDR-TH_2P-P2.54-V-M-3]  33.27 5.75 0 top
U14  TSW-102-07-F-S  [HDR-TH_2P-P2.54-V-M-3]  38.86 8.54 0 top

## Footprints (pads in the part's own frame, mm; a bottom-side part is the same pattern mirrored in y, then rotated)
C1206
  rect 1.485x1.728 smd: 1(-1.593,0) 2(1.593,0)
CAP-D10.0×F5.0
  round 1.524 hole 0.914: 1(-2.54,0) 2(2.54,0)
CAP-SMD_L3.5-W2.8-R-RD
  rect 1.9x2.376 smd: 1(1.899,0) 2(-1.899,0)
CONN-TH_DEGSON_DG301-5.0-04P
  round 2 hole 1.2: 1(-7.5,0) 2(-2.5,0) 3(2.5,0) 4(7.5,0)
DIL8-P
  oval 1.308x2.616 hole 0.8x0.805: 1(-3.81,-3.81) 2(-1.27,-3.81) 3(1.27,-3.81) 4(3.81,-3.81) 5(3.81,3.81) 6(1.27,3.81) 7(-1.27,3.81) 8(-3.81,3.81)
DS3231
  round 1.524 hole 0.914: 1(-1.27,1.27) 2(-1.27,-1.27) 3(-1.27,-3.81) 4(-1.27,-6.35) 5(-1.27,-8.89) 6(-1.27,-11.43) 7(34.29,-8.89) 8(34.29,-6.35) 9(34.29,-3.81) 10(34.29,-1.27)
E22P-868M30S
  rect 2.54x1.524 hole 0.914: 1(12.065,-15.24) 2(12.065,-12.7) 3(12.065,-10.16) 4(12.065,-2.54) 5(12.065,0) 6(12.065,2.54) 7(12.065,5.08) 8(12.065,7.62) 9(12.065,10.16) 10(12.065,12.7) 11(12.065,15.24) 12(-12.065,15.24) 13(-12.065,12.7) 14(-12.065,10.16) 15(-12.065,7.62) 16(-12.065,5.08) 17(-12.065,2.54) 18(-12.065,0) 19(-12.065,-2.54) 20(-12.065,-10.16) 21(-12.065,-12.7) 22(-12.065,-15.24)
HDR-TH_2P-P2.54-V-M-3
  rect 1.8x1.8 hole 1.1: 1(-1.27,0)
  round 1.8 hole 1.1: 2(1.27,0)
HDR-TH_4P-P2.54-V-M
  rect 1.7x1.7 hole 1.1: 1(-3.81,0)
  round 1.7 hole 1.1: 2(-1.27,0) 3(1.27,0) 4(3.81,0)
IND-TH_BD10.0-P5.00-D0.6
  round 1.5 hole 0.9: 1(-2.5,0) 2(2.5,0)
LED-SMD_CZ1206BH
  rect 0.8x1.7 smd: 1(-1.25,0) 2(1.25,0)
NRF52840_NANO_V2,0
  oval 3x1.8 hole 1.1: 0(1.143,31.75) 1(1.143,29.21) 2(1.143,26.67) 3(1.143,24.13) 4(1.143,21.59) 5(1.143,19.05) 6(1.143,16.51) 7(1.143,13.97) 8(1.143,11.43) 9(1.143,8.89) 10(1.143,6.35) 11(1.143,3.81) 12(1.143,1.27) 16(16.383,1.27) 17(16.383,3.81) 18(16.383,6.35) 19(16.383,8.89) 20(16.383,11.43) 21(16.383,13.97) 22(16.383,16.51) 23(16.383,19.05) 24(16.383,21.59) 25(16.383,24.13) 26(16.383,26.67) 27(16.383,29.21) 28(16.383,31.75)
Pad_e19
  round 1.524 hole 0.914: 1(0,0)
Pad_e20
  round 1.524 hole 0.914: 1(0,0)
Pad_e21
  round 1 hole 0.7: 1(0,0)
R1206
  rect 1.208x1.701 smd: 1(-1.479,0) 2(1.479,0)
SD30CRMA
  rect 2.5x2.5 hole 1.5x1.5: 1(2.032,-7.62) 2(2.032,-12.7) 3(42.545,-7.62) 4(42.544,-12.7)
SHORT_PAD
  custom 1.579x1.003 smd: 1(-0.29,-0.001)
  custom 1.528x1.012 smd: 2(1.014,0.006)
SOIC-8_L4.9-W3.9-P1.27-LS6.0-BL
  oval 0.588x2.045 smd: 1(-1.905,-2.57) 2(-0.635,-2.57) 3(0.635,-2.57) 4(1.905,-2.57) 5(1.905,2.57) 6(0.635,2.57) 7(-0.635,2.57) 8(-1.905,2.57)
SOT-23-3_L2.9-W1.3-P1.90-LS2.4-BR
  rect 1.25x0.7 smd: 1(1,-0.95) 2(1,0.95) 3(-1,0)
TO-92-3_L4.9-W3.7-P2.54-L
  rect 1.8x1.8 hole 1: 1(-2.54,0)
  round 1.8 hole 1: 2(0,0) 3(2.54,0)
XL63070
  round 1.524 hole 0.914: 1(0,0) 1(0,-2.54) 2(0,-10.17) 2(0,-12.71) 3(5.4,-13.16) 4(26.82,0) 4(26.82,-2.54) 5(26.82,-10.17) 5(26.82,-12.71)

## Nets
As in the schematic, except:
+3V3: H1.4 NOREF#2.1 R3.2 R6.2 R7.2 R8.2 R10.2 R17.1 R18.1 R20.2 R22.2 R23.2 R25.2 U1.24 U3.9
+5V: C8.1 C9.1 C11.2 J2.2 NOREF#3.1 U4.4 U10.1
VBAT: C14.1 C15.1 CN1.4 IC1.1 J2.1 NOREF.1 P1.3 R1.2 R9.2 R15.2 R16.1 R26.1 U4.1 U9.3

Pads without a net: U1 8 12; U2 21; U3 2 3 4 5 6

## Via types
v1: diameter 0.61, hole 0.305, Top Layer to Bottom Layer, 12 vias
v2: diameter 1, hole 0.4, Top Layer to Bottom Layer, 2 vias
v3: diameter 5.5, hole 3.2, Top Layer to Bottom Layer, 4 vias
v4: diameter 1, hole 0.6, Top Layer to Bottom Layer, 5 vias

## Routing (per net, layer and track width the routed paths; a pad name or vN(x,y) marks a point on that pad's centre or on a via; arc(x,y) is an arc through that point)
+3V3: length 204.8
  Top Layer w1: v1(24.77,11.08) v1(35.69,11.08) 54.89,11.08 NOREF#2.1 ; v1(65.91,55.53) 59.56,55.53 55.75,59.34 U3.9 ; v1(47.75,34.83) 47.75,11.09
  Bottom Layer w1: R8.2 54.69,8.58 NOREF#2.1 R7.2 57.15,11.12 57.15,34.32 58.8,35.97 62.74,35.97 ; R20.2 R22.2 24,11.08 15.24,19.84 15.24,32.21 ; R25.2 R23.2 ; R3.2 16.26,32.21 15.24,32.21 ; 15.24,32.21 R6.2 ; 62.74,35.97 62.74,45.11 65.91,48.29 v1(65.91,55.53) 65.87,55.57 R18.1 R17.1 83.19,64.42 87.25,68.48 91.44,68.48 93.09,66.83 H1.4 ; 62.74,35.97 64.64,34.07 66.42,34.07 ; R10.2 47.75,32.97 v1(47.75,34.83)
+5V: length 39.9
  Top Layer w1: NOREF#3.1 30.99,67.21
  Top Layer w1.5: U10.1 34.08,53.97 31.75,56.29 v4(31.75,65.77) NOREF#3.1
  Bottom Layer w1: U4.4 U4.4
  Bottom Layer w1.5: NOREF#3.1 37.21,67.21 38.21,66.22 C9.1 C8.1 48.68,66.22 U4.4
GND: length 0.8
  Bottom Layer w1: Q1.2 v1(19.75,30.26)
  vias: v2(38.1,42.19) v2(39.12,40.67) v3(3,74.5) v3(3,3.5) v3(97,74.5) v3(97,3.5)
VBAT: length 253.7
  Top Layer w1: 20.49,10.08 U9.3 20.49,20.52 23.75,23.78 NOREF.1 C14.1 23.62,38.89 C15.1 ; U4.1 U4.1 v1(27.31,67.21) 28.81,67.21
  Top Layer w2: CN1.4 26.17,4.98 21.08,10.06 6.98,10.06 3.68,13.37 3.68,46 7.75,50.07 P1.3 7.75,71.28 9.4,72.93 20.83,72.93 22.86,70.9 U4.1
  Bottom Layer w1: U9.3 20.49,19.8 R16.1 ; R15.2 23.75,38.68 C14.1 ; IC1.1 28.19,20.98 NOREF.1 ; R9.2 v1(27.31,67.21) ; CN1.4 27.01,4.3 R26.1 ; R1.2 60.58,37.58 60.58,45.11 64.39,48.92 64.39,66.32 58.42,72.29 25.4,72.29 U4.1
E22_BUSY: length 14.8
  Bottom Layer w1: 66.42,28.99 67.69,28.99 68.95,30.25 68.95,36.22 71.2,38.47 U2.14
E22_DIO1: length 29.5
  Top Layer w1: U2.13 71.96,41.01 69.22,38.26 69.22,17.94 67.56,16.29 66.42,16.29
E22_MISO: length 12.2
  Bottom Layer w1: U2.16 72.09,33.39 70.23,31.53 70.23,28.1 68.58,26.45 66.42,26.45
E22_MOSI: length 12.3
  Bottom Layer w1: U2.17 72.5,30.85 71.5,29.85 71.5,26.29 69.12,23.91 66.42,23.91
E22_NSS: length 9.2
  Bottom Layer w1: U2.19 69.39,21.37 66.42,21.37
E22_RST: length 27.2
  Top Layer w1: 66.42,13.75 68.33,13.75 70.99,16.41 70.99,34.57 72.34,35.93 U2.15
E22_RXEN: length 76.9
  Top Layer w1: v1(70.36,10.44) 64.64,10.44 60.83,14.25 60.83,27.46 56.77,31.53 U1.5
  Bottom Layer w1: v1(70.36,10.44) 81.66,10.44 89.41,18.19 89.41,27.08 93.17,30.85 U2.6
E22_SCK: length 17.8
  Bottom Layer w1: 66.42,18.83 70.36,18.83 76.07,24.54 76.07,27.72 75.37,28.42 73.91,28.42 U2.18
I2C_SCL: length 57.1
  Bottom Layer w1: 56.39,64.22 56.39,39.78 53.72,37.11 53.72,20.48 52.07,18.83 U1.10 ; R17.2 U3.7
I2C_SDA: length 57.3
  Top Layer w1: v1(60.2,58.2) 56.51,61.88 53.85,61.88
  Bottom Layer w1: U1.11 52.96,16.29 55.37,18.7 55.37,35.97 58.29,38.89 58.29,48.67 60.2,50.58 v1(60.2,58.2) R18.2
NETPORT2: length 36.2
  Bottom Layer w1: U1.6 49.28,28.99 45.09,24.8 45.09,18.7 44.2,17.81 40.89,17.81 39.12,16.03 30.76,16.03 29.76,15.03 29.76,13.62 R20.1 ; Q3.1 29.91,13.47
NETPORT3: length 24.1
  Bottom Layer w1: R24.2 39.2,14.13 R25.1 ; R24.2 40.81,15.31 41.85,16.35 44.89,16.35 46.67,18.13 46.67,23.21 49.91,26.45 U1.7 ; R24.2 40.81,11.47
PIC_MPPT_EN: length 38.4
  Bottom Layer w1: IC1.2 34.54,20.1 33.27,18.83 27.69,18.83 24.38,22.13 18.16,22.13 16.85,23.44 16.85,28.48 Q1.1 17.85,33.87 16.56,35.16 R6.1 R4.2
PIC_PWR_EN: length 35.7
  Top Layer w1: v1(42.54,35.08) 31.32,46.31 v4(31.32,52.66)
  Bottom Layer w1: IC1.5 42.84,28.61 R5.2 R10.1 42.59,35.08 v1(42.54,35.08) ; v4(31.32,52.66) 29.31,52.66 Q2.1
PWR_EN: length 7
  Bottom Layer w1: R9.1 27.31,59.47 28.26,58.51 U4.3 28.32,56.53 Q2.3
RST_NRF: length 33.6
  Top Layer w1: v1(62.74,25.56) 62.74,35.21 64.13,36.61 66.42,36.61
  Bottom Layer w1: 60.15,11.08 62.42,11.08 C1.2 ; C1.2 62.54,8.86 U5.1 ; C1.2 62.74,11.4 v1(62.74,25.56)
USR_BTN: length 18.3
  Bottom Layer w1: R8.1 U6.1 48.58,8.86 C2.2 48.58,20.16 49.78,21.37 U1.9
VRAW: length 110.5
  Top Layer w0.5: 66.42,41.69 68.58,41.69
  Top Layer w1.5: 66.42,41.69 63.12,41.69 58.17,46.64 48.64,46.64 ; 48.64,46.64 50.55,48.54 v4(75.95,48.54) ; 48.64,46.64 48.01,46 ; U2.10 U2.9
  Top Layer w2: v4(47.24,36.86) v4(47.24,38.01) 47.24,45.24 48.01,46
  Top Layer w2.5: 97.92,39.78 94.62,39.78 94.62,46.89 C17.1
  Bottom Layer w1: 42.42,38.51 40.74,36.83 39.53,36.83
  Bottom Layer w1.5: v4(75.95,48.54) 85.85,38.64 C6.1
  Bottom Layer w1.524: U2.9 88.57,38.47 C6.1
  Bottom Layer w2: R11.1 46.95,38.3 ; R13.2 v4(47.24,38.01)
VSOL: length 26.4
  Bottom Layer w2.5: CN1.1 11.17,8.42 9.14,10.44 C16.1 9.14,21.75 7.75,23.14 P1.1
$1N10: length 2.5
  Bottom Layer w1: U2.8 U2.7
$1N12: length 10.3
  Bottom Layer w1: R1.1 60.45,31.48 60.45,31.48 ; 60.45,31.48 R2.2 61.77,31.53 66.42,31.53 ; 60.45,31.48 59.19,31.48 C13.2
$1N32: length 13.6
  Bottom Layer w1: U8.1 U8.2 18.8,24.8 Q1.3 20.46,27.48 21.08,28.1 21.08,31.53 20.45,32.16 R3.1
$1N33: length 6.2
  Bottom Layer w0.5: R13.1 45,42.78 44.56,43.22 U7.5
$1N35: length 5.2
  Bottom Layer w0.5: C3.2 38.42,43.9 40.37,41.95 U7.6
$1N37: length 14.5
  Bottom Layer w0.5: R12.2 47.24,45.5 48.9,43.84 48.9,42.07 48.09,41.26 R11.2 44.02,41.26 43.45,40.68 U7.7
$1N43: length 21.4
  Bottom Layer w1: IC1.3 37.08,19.33 35.18,17.43 29.21,17.43 27.18,15.4 24.26,15.4 23.03,16.62 U9.2 23.03,20.05 R16.2
$1N45: length 10.1
  Bottom Layer w1: IC1.7 R14.2 34.5,32.29 32,32.29 31.75,32.54 C4.2 30.56,32.56 R15.1
$1N53: length 27.3
  Bottom Layer w1: U7.1 36.06,38.01 37.21,36.86 37.87,36.86
  Bottom Layer w1.5: U10.2 36.79,48.04 33.78,48.04 30.73,44.99 30.73,41.05 32.03,39.76 C12.2 36.07,39.76 ; C10.1 C7.1
$1N58: length 65.5
  Top Layer w1: H1.3 94.49,64.29 91.69,61.5 91.69,53.1 90.69,52.1 54.48,52.1 v1(53.59,51.21)
  Bottom Layer w1: U1.1 52.96,41.69 53.59,42.32 v1(53.59,51.21)
$1N62: length 65.7
  Top Layer w1: H1.2 94.87,61.75 93.22,60.1 93.22,52.1 91.69,50.58 55.25,50.58 v1(54.99,50.32)
  Bottom Layer w1: U1.2 53.47,39.15 54.99,40.67 v1(54.99,50.32)
$1N68: length 2.9
  Bottom Layer w0.5: R19.1 38.76,35.29 U11.2
$1N69: length 3.7
  Bottom Layer w1: R19.2 IC1.6
$1N72: length 4.8
  Bottom Layer w1: U12.1 42.42,22.13 41.28,20.98 IC1.4
$1N75: length 11
  Bottom Layer w1: R22.1 27.77,10.24 28.56,9.44 Q3.3 32,8.3 U13.1 U13.2
$1N84: length 7.6
  Bottom Layer w1: R23.1 38.69,10.53 37.59,9.43 U14.1 U14.2 40.88,8.54 Q4.3
$1N86: length 5.7
  Top Layer w1: 70.23,42.07 70.23,43.84 69.85,44.23 66.42,44.23
$1N3345: length 2.9
  Bottom Layer w1: CN1.3 21.17,5.9 Q5.3
$1N3704: length 12.5
  Bottom Layer w1: R26.2 24.05,2.74 22.61,1.3 19.69,1.3 18.8,2.19 18.8,5.29 Q5.1

## Copper pours and planes (outline as drawn; the poured copper is in the pictures)
GND on Top Layer: -1.4,79.02 101.22,79.02 101.22,-1.37 -1.4,-1.37
GND on Bottom Layer: -4.19,80.8 101.09,80.8 101.09,-4.03 -4.19,-4.03
VRAW on Bottom Layer: 40.51,39.65 45.09,39.65 45.09,37.75 40.51,37.75
$1N53 on Bottom Layer: 35.05,42.19 36.96,42.19 36.96,39.15 35.05,39.15

## Text on the board
Bottom Silkscreen Layer: V1.1 | Radek & Tomáš | RF magic here
Top Silkscreen Layer: MPPT_EN | PWR_EN | NETPORT3 | NETPORT2 | USR_BTN | NRF_RST | PIC Watchdog | VSOL GND BAT- VBAT | MC RouterBoard Radkovo mámy

# Board PCB_promicro_e22P_30_2
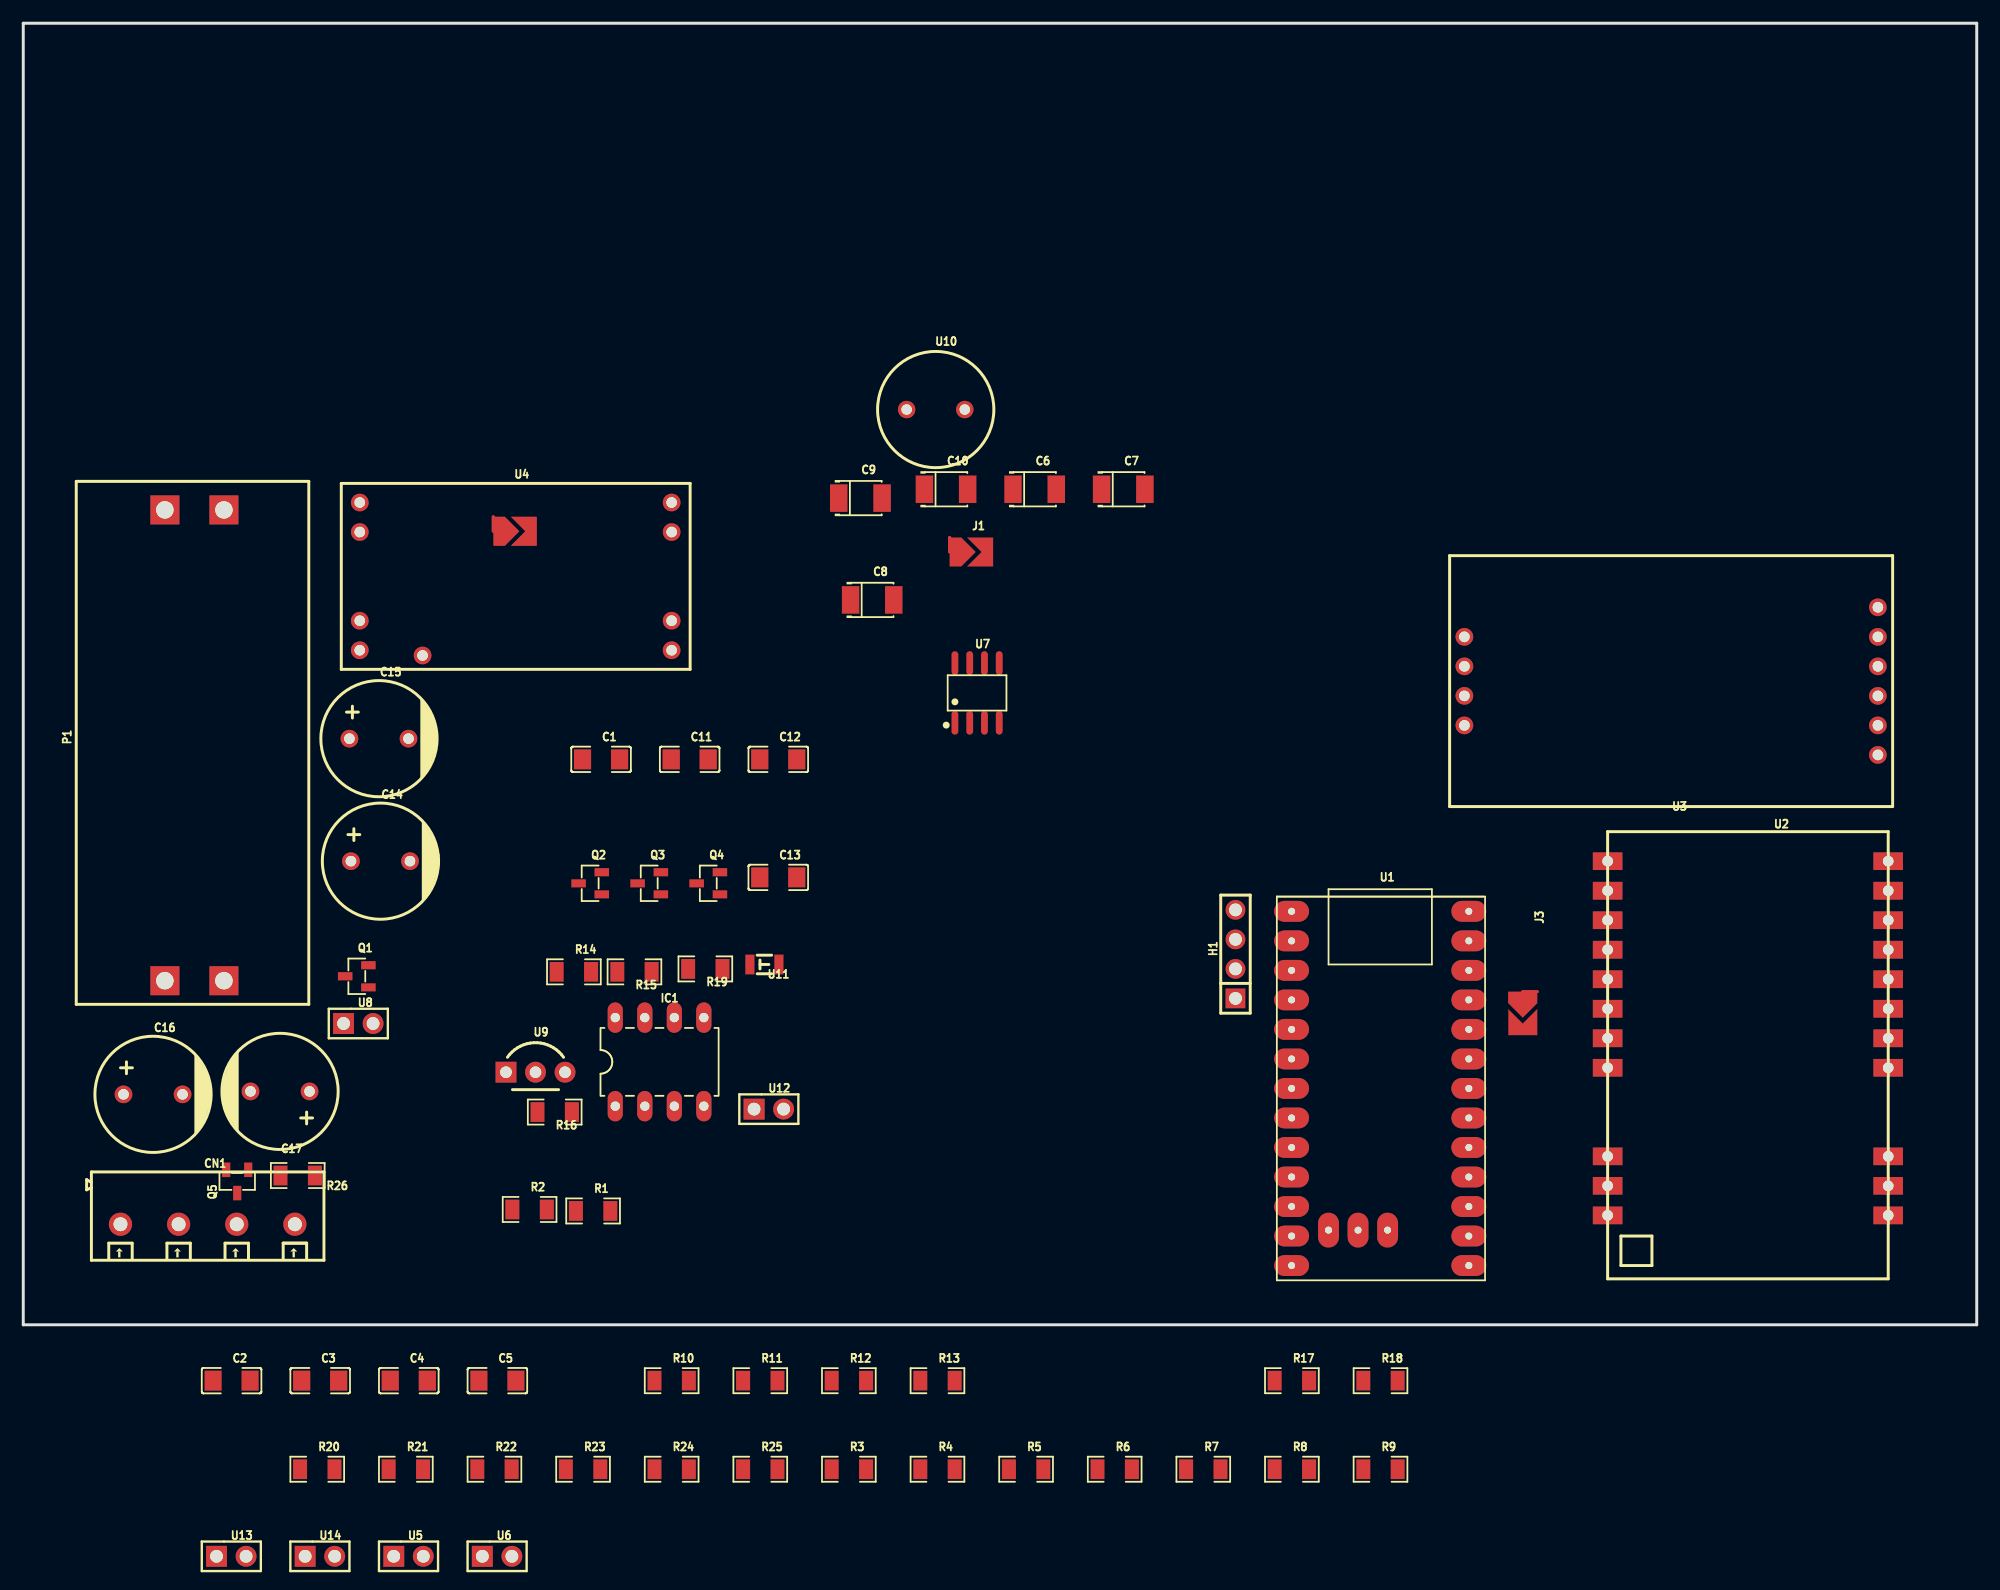
[diagram p4: board, top side]
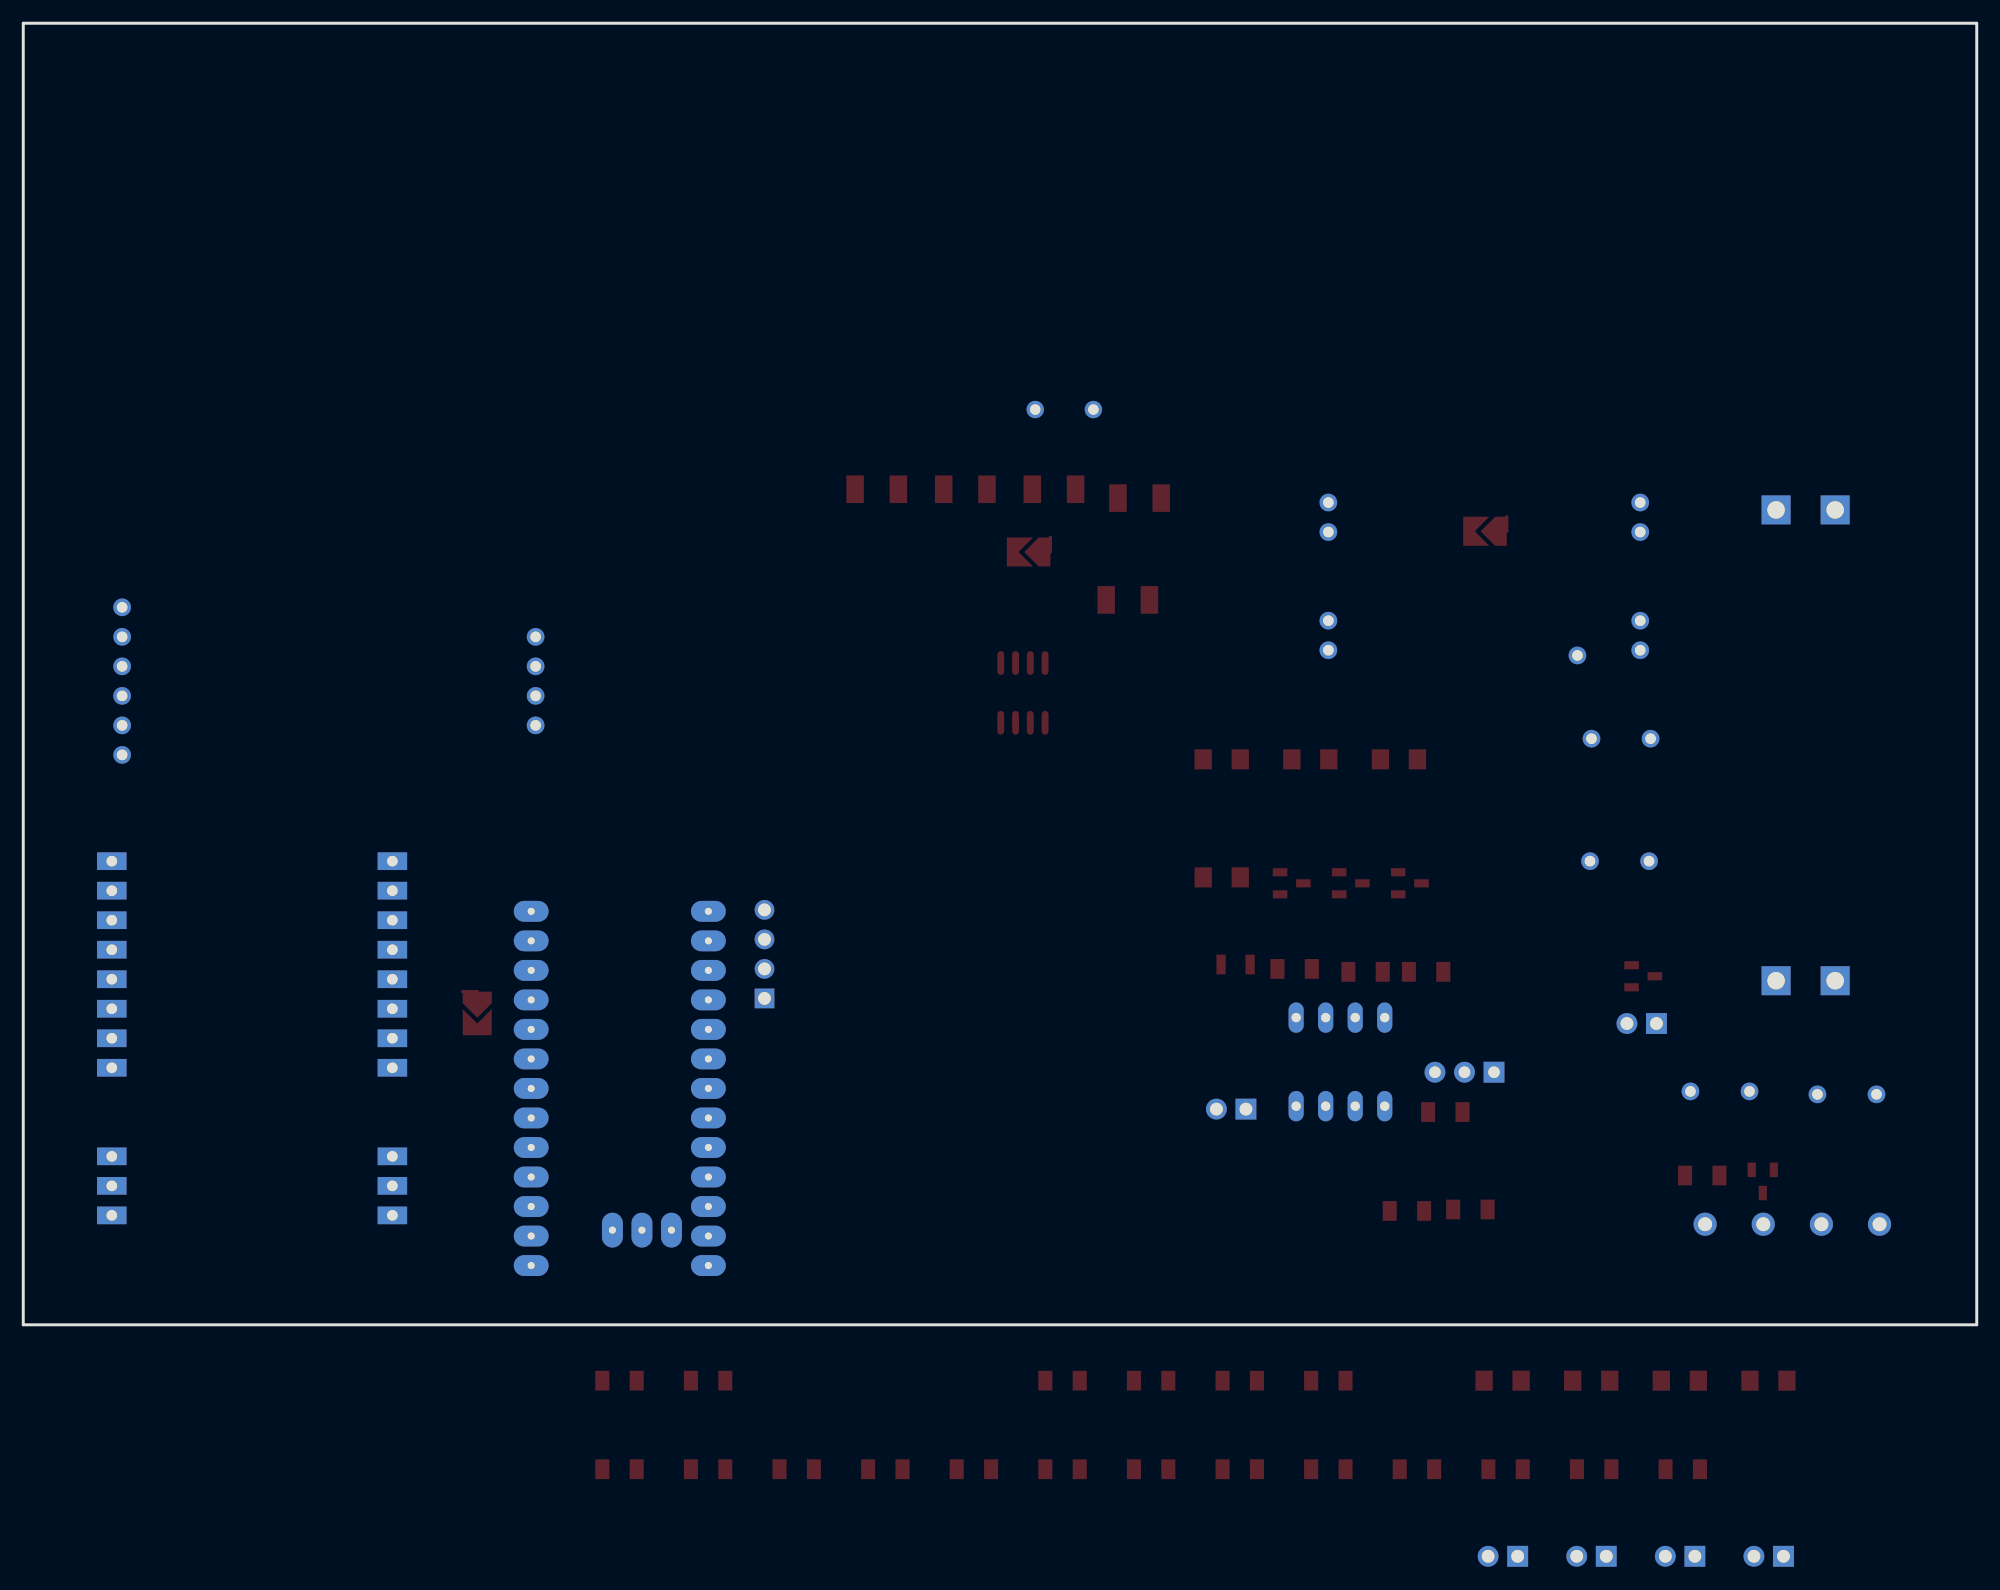
[diagram p5: board, bottom side, seen from below]

Outline 168 x 112 mm; copper layers: Top Layer, Bottom Layer. Coordinates in mm from the lower left corner of the outline.
Outline path: 0,112 168,112 168,0 0,0 0,112
Stack: Top Layer 0.035mm / Dielectric1 1.51mm FR4 er 4.5 / Bottom Layer 0.035mm

## Design rules (mm)
spacing Default (default): track to track 0.152, other pairs 0 to 0.152
spacing Plane_Default: track to track 0.152, other pairs 0 to 0.152
spacing Copper_Default: track to track 0.152, other pairs 0 to 0.152
track width Default (default): min 0.254, default 0.254, max 25.4
differential pair differentialPair (default): width min 0.127, default 0.254, max 2.54; gap min 0.152, default 0.152

## Placement (name value [footprint] x y rotation side)
C1  0.1u  [C1206]  49.69 48.66 0 top
C2  0.1u  [C1206]  17.92 -4.81 0 top
C3  0.1u  [C1206]  25.54 -4.81 0 top
C4  0.1u  [C1206]  33.16 -4.81 0 top
C5  0.1u  [C1206]  40.78 -4.81 0 top
C6  1u  [CASE-B_3528]  86.98 71.9 0 top
C7  1u  [CASE-B_3528]  94.6 71.9 0 top
C8  1u  [CASE-B_3528]  73.01 62.38 0 top
C9  1u  [CASE-B_3528]  71.99 71.14 0 top
C10  1u  [CASE-B_3528]  79.36 71.9 0 top
C11  0.1u  [C1206]  57.31 48.66 0 top
C12  0.1u  [C1206]  64.93 48.66 0 top
C13  0.1u  [C1206]  64.93 38.5 0 top
C14  1u  [CAP-D10.0×F5.0]  30.72 39.9 0 top
C15  1u  [CAP-D10.0×F5.0]  30.59 50.44 0 top
C16  1u  [CAP-D10.0×F5.0]  11.16 19.83 0 top
C17  1u  [CAP-D10.0×F5.0]  22.08 20.08 180 top
CN1  DG301-5.0-04P-14-1000A(H)  [CONN-TH_DEGSON_DG301-5.0-04P]  15.86 8.65 0 top
H1  TSW-104-07-T-S  [HDR-TH_4P-P2.54-V-M]  104.25 31.9 90 top
IC1  PIC12F1840/P  [DIL8-P]  54.72 22.62 0 top
J1  ShortPad  [SHORTPAD]  74.66 62.76 0 top
J2  ShortPad  [SHORTPAD]  35.42 64.53 0 top
J3  ShortPad  [SHORTPAD]  125.21 33.67 270 top
P1  -  [SD30CRMA]  4.56 27.58 90 top
Q1  SI2312  [SOT-23-3_L2.9-W1.3-P1.90-LS2.4-BR]  28.69 29.99 0 top
Q2  SI2312  [SOT-23-3_L2.9-W1.3-P1.90-LS2.4-BR]  48.75 37.99 0 top
Q3  SI2312  [SOT-23-3_L2.9-W1.3-P1.90-LS2.4-BR]  53.83 37.99 0 top
Q4  SI2312  [SOT-23-3_L2.9-W1.3-P1.90-LS2.4-BR]  58.91 37.99 0 top
Q5  SI2302  [SOT-23-3_L2.9-W1.3-P1.90-LS2.4-BR]  18.4 12.34 90 top
R1  1k  [R1206]  49.01 9.8 0 top
R2  1k  [R1206]  43.55 9.92 0 top
R3  1k  [R1206]  71 -12.43 0 top
R4  1k  [R1206]  78.62 -12.43 0 top
R5  1k  [R1206]  86.24 -12.43 0 top
R6  1k  [R1206]  93.86 -12.43 0 top
R7  1k  [R1206]  101.48 -12.43 0 top
R8  1k  [R1206]  109.1 -12.43 0 top
R9  1k  [R1206]  116.72 -12.43 0 top
R10  1k  [R1206]  55.76 -4.81 0 top
R11  1k  [R1206]  63.38 -4.81 0 top
R12  1k  [R1206]  71 -4.81 0 top
R13  1k  [R1206]  78.62 -4.81 0 top
R14  1k  [R1206]  47.36 30.37 0 top
R15  1k  [R1206]  52.56 30.37 180 top
R16  1k  [R1206]  45.7 18.31 180 top
R17  1k  [R1206]  109.1 -4.81 0 top
R18  1k  [R1206]  116.72 -4.81 0 top
R19  1k  [R1206]  58.66 30.62 180 top
R20  1k  [R1206]  25.28 -12.43 0 top
R21  1k  [R1206]  32.9 -12.43 0 top
R22  1k  [R1206]  40.52 -12.43 0 top
R23  1k  [R1206]  48.14 -12.43 0 top
R24  1k  [R1206]  55.76 -12.43 0 top
R25  1k  [R1206]  63.38 -12.43 0 top
R26  1k  [R1206]  23.61 12.84 180 top
U1  NRF52840_Nano_v2.0  [NRF52840_NANO_V2,0]  107.94 3.83 0 top
U2  -  [E22P-868M30S]  148.32 24.66 0 top
U3  -  [DS3231]  158.23 50.31 180 top
U4  -  [XL63070]  28.94 70.76 0 top
U5  TSW-102-07-F-S  [HDR-TH_2P-P2.54-V-M-3]  33.13 -19.92 0 top
U6  TSW-102-07-F-S  [HDR-TH_2P-P2.54-V-M-3]  40.75 -19.92 0 top
U7  MCP1727-ADJE/SN  [SOIC-8_L4.9-W3.9-P1.27-LS6.0-BL]  82.03 54.37 0 top
U8  TSW-102-07-F-S  [HDR-TH_2P-P2.54-V-M-3]  28.81 25.93 0 top
U9  DS18B20+T&R  [TO-92-3_L4.9-W3.7-P2.54-L]  44.05 21.74 0 top
U10  33UH/1A  [IND-TH_BD10.0-P5.00-D0.6]  78.47 78.76 0 top
U11  CZ1206BH  [LED-SMD_CZ1206BH]  63.74 31.01 180 top
U12  TSW-102-07-F-S  [HDR-TH_2P-P2.54-V-M-3]  64.12 18.56 0 top
U13  TSW-102-07-F-S  [HDR-TH_2P-P2.54-V-M-3]  17.89 -19.92 0 top
U14  TSW-102-07-F-S  [HDR-TH_2P-P2.54-V-M-3]  25.51 -19.92 0 top

## Footprints (pads in the part's own frame, mm; a bottom-side part is the same pattern mirrored in y, then rotated)
C1206
  rect 1.485x1.728 smd: 1(-1.593,0) 2(1.593,0)
CAP-D10.0×F5.0
  round 1.524 hole 0.914: 1(-2.54,0) 2(2.54,0)
CASE-B_3528
  rect 1.506x2.376 smd: 1(-1.861,0) 2(1.861,0)
CONN-TH_DEGSON_DG301-5.0-04P
  round 2 hole 1.2: 1(-7.5,0) 2(-2.5,0) 3(2.5,0) 4(7.5,0)
DIL8-P
  oval 1.308x2.616 hole 0.8x0.805: 1(-3.81,-3.81) 2(-1.27,-3.81) 3(1.27,-3.81) 4(3.81,-3.81) 5(3.81,3.81) 6(1.27,3.81) 7(-1.27,3.81) 8(-3.81,3.81)
DS3231
  round 1.524 hole 0.914: 1(-1.27,1.27) 2(-1.27,-1.27) 3(-1.27,-3.81) 4(-1.27,-6.35) 5(-1.27,-8.89) 6(-1.27,-11.43) 7(34.29,-8.89) 8(34.29,-6.35) 9(34.29,-3.81) 10(34.29,-1.27)
E22P-868M30S
  rect 2.54x1.524 hole 0.914: 1(12.065,-15.24) 2(12.065,-12.7) 3(12.065,-10.16) 4(12.065,-2.54) 5(12.065,0) 6(12.065,2.54) 7(12.065,5.08) 8(12.065,7.62) 9(12.065,10.16) 10(12.065,12.7) 11(12.065,15.24) 12(-12.065,15.24) 13(-12.065,12.7) 14(-12.065,10.16) 15(-12.065,7.62) 16(-12.065,5.08) 17(-12.065,2.54) 18(-12.065,0) 19(-12.065,-2.54) 20(-12.065,-10.16) 21(-12.065,-12.7) 22(-12.065,-15.24)
HDR-TH_2P-P2.54-V-M-3
  rect 1.8x1.8 hole 1.1: 1(-1.27,0)
  round 1.8 hole 1.1: 2(1.27,0)
HDR-TH_4P-P2.54-V-M
  rect 1.7x1.7 hole 1.1: 1(-3.81,0)
  round 1.7 hole 1.1: 2(-1.27,0) 3(1.27,0) 4(3.81,0)
IND-TH_BD10.0-P5.00-D0.6
  round 1.5 hole 0.9: 1(-2.5,0) 2(2.5,0)
LED-SMD_CZ1206BH
  rect 0.8x1.7 smd: 1(-1.25,0) 2(1.25,0)
NRF52840_NANO_V2,0
  oval 3x1.8 hole 0.61: 0(1.143,31.75) 1(1.143,29.21) 2(1.143,26.67) 3(1.143,24.13) 4(1.143,21.59) 5(1.143,19.05) 6(1.143,16.51) 7(1.143,13.97) 8(1.143,11.43) 9(1.143,8.89) 10(1.143,6.35) 11(1.143,3.81) 12(1.143,1.27) 16(16.383,1.27) 17(16.383,3.81) 18(16.383,6.35) 19(16.383,8.89) 20(16.383,11.43) 21(16.383,13.97) 22(16.383,16.51) 23(16.383,19.05) 24(16.383,21.59) 25(16.383,24.13) 26(16.383,26.67) 27(16.383,29.21) 28(16.383,31.75)
  oval 1.8x3 hole 0.61: 13(4.318,4.318) 14(6.858,4.318) 15(9.398,4.318)
R1206
  rect 1.208x1.701 smd: 1(-1.479,0) 2(1.479,0)
SD30CRMA
  rect 2.5x2.5 hole 1.5x1.5: 1(2.032,-7.62) 2(2.032,-12.7) 3(42.545,-7.62) 4(42.544,-12.7)
SHORTPAD
  round 0.6 smd: 1(5.5,3.75) 2(8.252,3.748)
SOIC-8_L4.9-W3.9-P1.27-LS6.0-BL
  oval 0.588x2.045 smd: 1(-1.905,-2.57) 2(-0.635,-2.57) 3(0.635,-2.57) 4(1.905,-2.57) 5(1.905,2.57) 6(0.635,2.57) 7(-0.635,2.57) 8(-1.905,2.57)
SOT-23-3_L2.9-W1.3-P1.90-LS2.4-BR
  rect 1.25x0.7 smd: 1(1,-0.95) 2(1,0.95) 3(-1,0)
TO-92-3_L4.9-W3.7-P2.54-L
  rect 1.8x1.8 hole 1: 1(-2.54,0)
  round 1.8 hole 1: 2(0,0) 3(2.54,0)
XL63070
  round 1.524 hole 0.914: 1(0,0) 1(0,-2.54) 2(0,-10.17) 2(0,-12.71) 3(5.4,-13.16) 4(26.82,0) 4(26.82,-2.54) 5(26.82,-10.17) 5(26.82,-12.71)

## Nets
As in the schematic.

Pads without a net: U1 8 12 13 14 15; U2 21; U3 2 3 4 5 6
